# EAGLE design xcore_A (EAGLE 7.7.0)

## Sheet 1 of 2
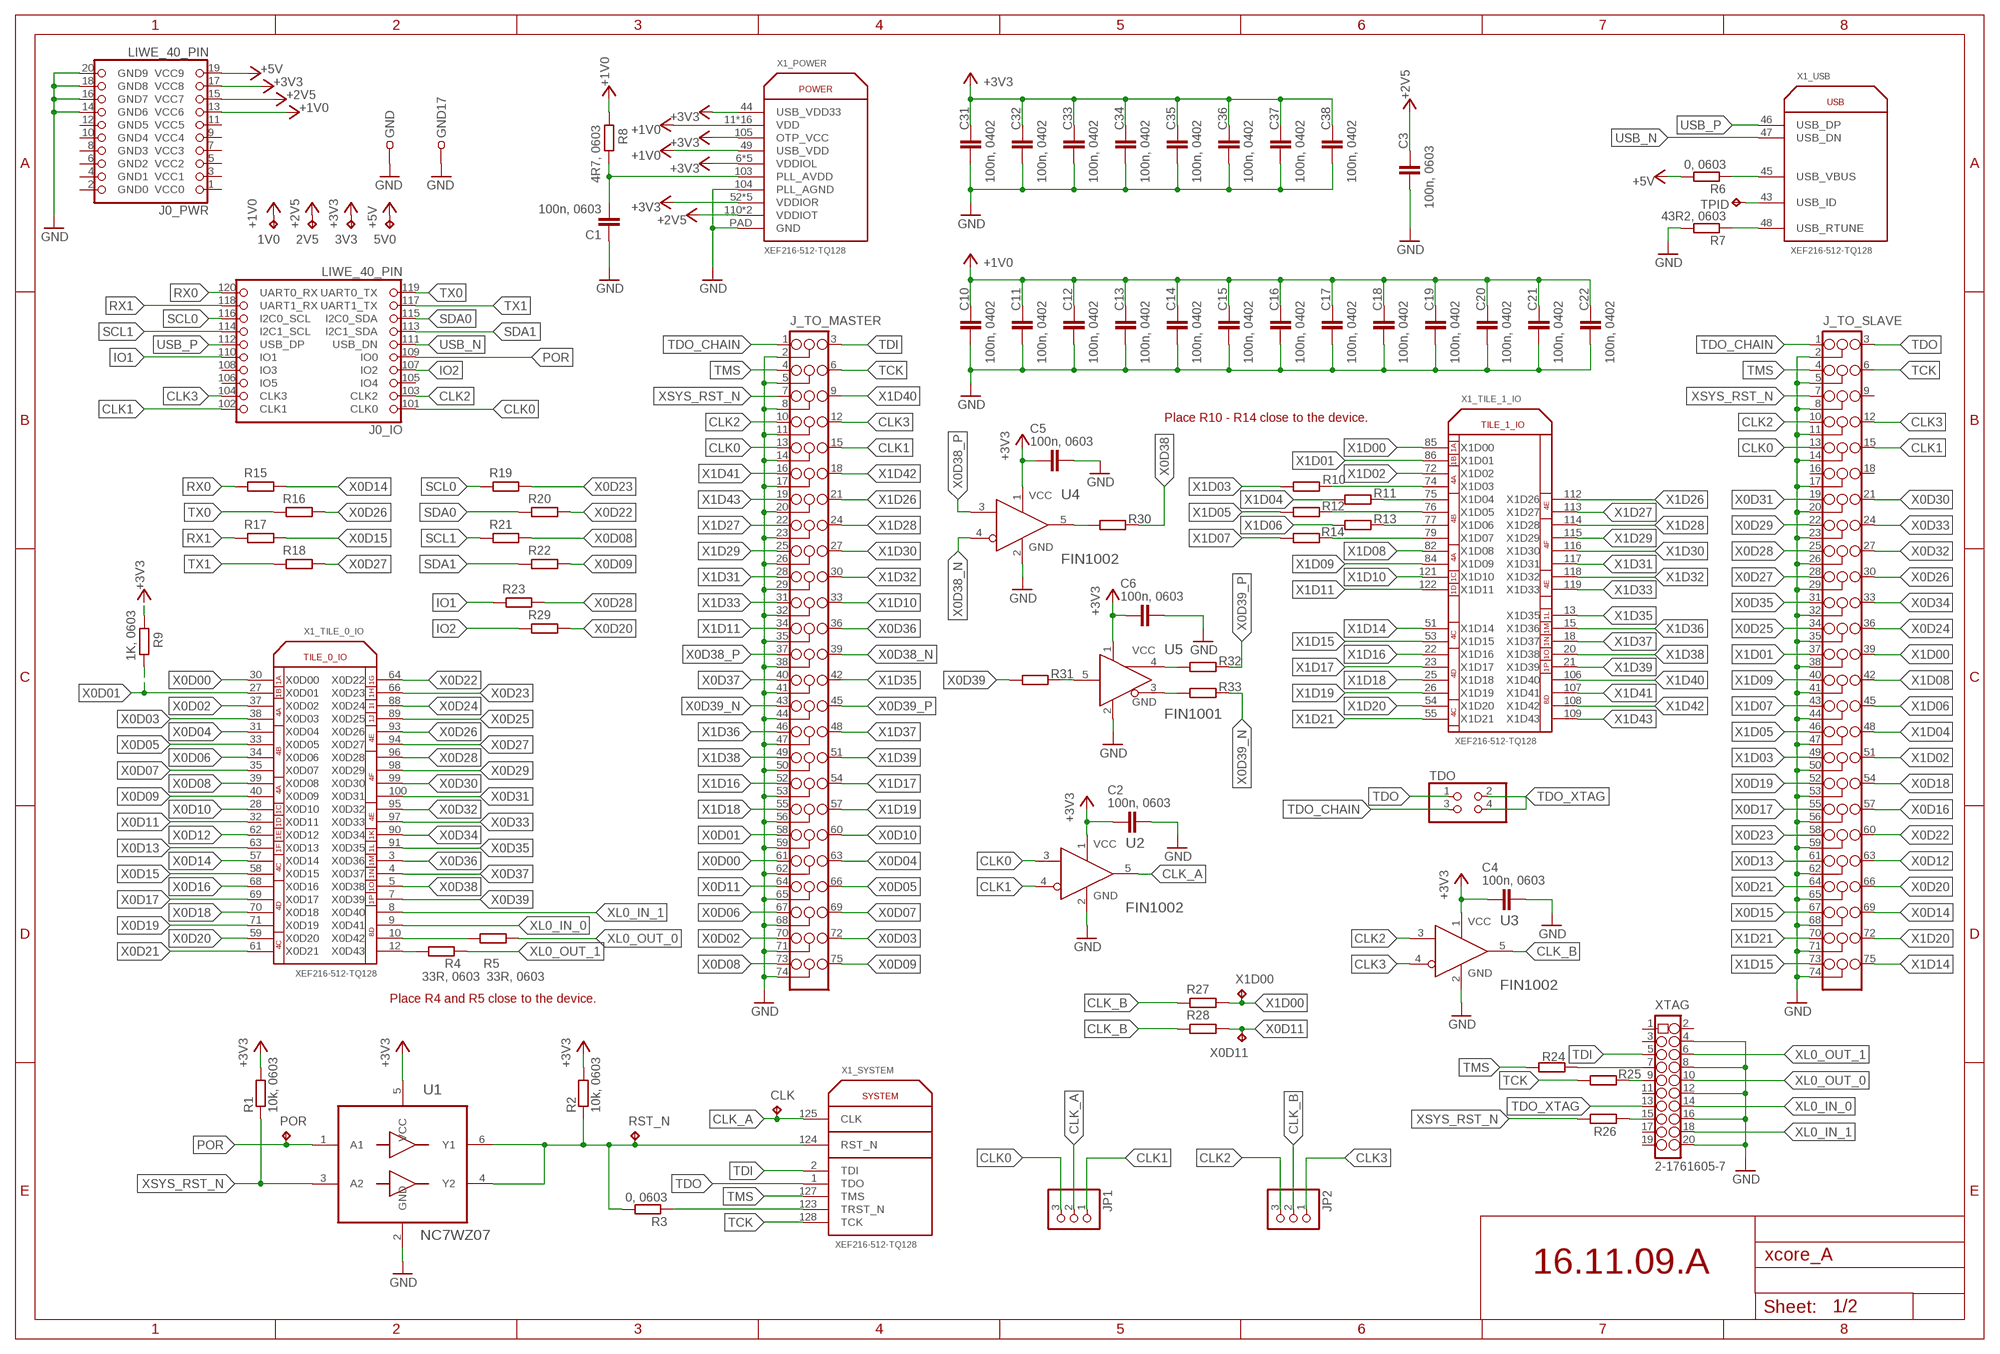
[diagram p0: schematic, sheet 1]

### Parts
1V0  TPTP14R  [TP14R]
2V5  TPTP14R  [TP14R]
3V3  TPTP14R  [TP14R]
5V0  TPTP14R  [TP14R]
C1  100n, 0603  C-EUC0603  [C0603]
C2  100n, 0603  C-EUC0603  [C0603]
C3  100n, 0603  C-EUC0402K  [C0402K]
C4  100n, 0603  C-EUC0603  [C0603]
C5  100n, 0603  C-EUC0603  [C0603]
C6  100n, 0603  C-EUC0603  [C0603]
C10  100n, 0402  C-EUC0402K  [C0402K]
C11  100n, 0402  C-EUC0402K  [C0402K]
C12  100n, 0402  C-EUC0402K  [C0402K]
C13  100n, 0402  C-EUC0402K  [C0402K]
C14  100n, 0402  C-EUC0402K  [C0402K]
C15  100n, 0402  C-EUC0402K  [C0402K]
C16  100n, 0402  C-EUC0402K  [C0402K]
C17  100n, 0402  C-EUC0402K  [C0402K]
C18  100n, 0402  C-EUC0402K  [C0402K]
C19  100n, 0402  C-EUC0402K  [C0402K]
C20  100n, 0402  C-EUC0402K  [C0402K]
C21  100n, 0402  C-EUC0402K  [C0402K]
C22  100n, 0402  C-EUC0402K  [C0402K]
C31  100n, 0402  C-EUC0402K  [C0402K]
C32  100n, 0402  C-EUC0402K  [C0402K]
C33  100n, 0402  C-EUC0402K  [C0402K]
C34  100n, 0402  C-EUC0402K  [C0402K]
C35  100n, 0402  C-EUC0402K  [C0402K]
C36  100n, 0402  C-EUC0402K  [C0402K]
C37  100n, 0402  C-EUC0402K  [C0402K]
C38  100n, 0402  C-EUC0402K  [C0402K]
CLK  TPTP14R  [TP14R]
GND  TEST-22-MULTICOMP  [TEST_1MM]
GND17  TEST-22-MULTICOMP  [TEST_1MM]
J0  LIWE_40_PIN  [LIWE_40_PIN_8X8]
J_TO_MASTER  TSW-125-08-G-T-RA  PINHD-3X25/90/M  [3X25/90/M]
J_TO_SLAVE  TSW-125-08-G-T-RA  PINHD-3X25/90  [3X25/90]
JP1  PINHD-1X3  [1X03]
JP2  PINHD-1X3  [1X03]
POR  TPTP14R  [TP14R]
R1  10k, 0603  R-EU_R0603  [R0603]
R2  10k, 0603  R-EU_R0603  [R0603]
R3  0, 0603  R-EU_R0603  [R0603]
R4  33R, 0603  R-EU_R0603  [R0603]
R5  33R, 0603  R-EU_R0603  [R0603]
R6  0, 0603  R-EU_R0603  [R0603]
R7  43R2, 0603  R-EU_R0603  [R0603]
R8  4R7, 0603  R-EU_R0603  [R0603]
R9  1K, 0603  R-EU_R0603  [R0603]
R10  R-EU_R0603  [R0603]
R11  R-EU_R0603  [R0603]
R12  R-EU_R0603  [R0603]
R13  R-EU_R0603  [R0603]
R14  R-EU_R0603  [R0603]
R15  R-EU_R0603  [R0603]
R16  R-EU_R0603  [R0603]
R17  R-EU_R0603  [R0603]
R18  R-EU_R0603  [R0603]
R19  R-EU_R0603  [R0603]
R20  R-EU_R0603  [R0603]
R21  R-EU_R0603  [R0603]
R22  R-EU_R0603  [R0603]
R23  R-EU_R0603  [R0603]
R24  R-EU_R0603  [R0603]
R25  R-EU_R0603  [R0603]
R26  R-EU_R0603  [R0603]
R27  R-EU_R0603  [R0603]
R28  R-EU_R0603  [R0603]
R29  R-EU_R0603  [R0603]
R30  R-EU_R0603  [R0603]
R31  R-EU_R0603  [R0603]
R32  R-EU_R0603  [R0603]
R33  R-EU_R0603  [R0603]
RST_N  TPTP14R  [TP14R]
TDO  PINHD-2X2  [2X02]
TPID  TPB1,27  [B1,27]
U1  NC7WZ07  [SOT65P210X110-6N]
U2  FIN1002  [SOT95P280X140-5N]
U3  FIN1002  [SOT95P280X140-5N]
U4  FIN1002  [SOT95P280X140-5N]
U5  FIN1001  [SOT95P280X140-5N]
X0D11  TPTP14R  [TP14R]
X1  XEF216-512-TQ128  [TQFP128]
X1D00  TPTP14R  [TP14R]
XTAG  2-1761605-7  PINHD-2X10  [2X10]

### Nets
+1V0: 1V0.TP C10.2 C11.2 C12.2 C13.2 C14.2 C15.2 C16.2 C17.2 C18.2 C19.2 C20.2 C21.2 C22.2 J0.13(_PWR:VCC6) R8.1 X1.11(_POWER:VDD) X1.16(_POWER:VDD) X1.17(_POWER:VDD) X1.24(_POWER:VDD) X1.36(_POWER:VDD) X1.41(_POWER:VDD) X1.49(_POWER:USB_VDD) X1.56(_POWER:VDD) X1.60(_POWER:VDD) X1.73(_POWER:VDD) X1.80(_POWER:VDD) X1.81(_POWER:VDD) X1.87(_POWER:VDD) X1.101(_POWER:VDD) X1.102(_POWER:VDD) X1.120(_POWER:VDD) X1.126(_POWER:VDD)
+2V5: 2V5.TP C3.2 J0.15(_PWR:VCC7) X1.110(_POWER:VDDIOT) X1.111(_POWER:VDDIOT)
+3V3: 3V3.TP C2.2 C4.2 C5.2 C6.2 C31.2 C32.2 C33.2 C34.2 C35.2 C36.2 C37.2 C38.2 J0.17(_PWR:VCC8) R1.2 R2.2 R9.1 U1.5(VCC) U2.1(VCC) U3.1(VCC) U4.1(VCC) U5.1(VCC) X1.6(_POWER:VDDIOL) X1.14(_POWER:VDDIOL) X1.19(_POWER:VDDIOL) X1.29(_POWER:VDDIOL) X1.42(_POWER:VDDIOL) X1.44(_POWER:USB_VDD33) X1.52(_POWER:VDDIOR) X1.67(_POWER:VDDIOR) X1.78(_POWER:VDDIOR) X1.83(_POWER:VDDIOR) X1.92(_POWER:VDDIOR) X1.105(_POWER:OTP_VCC)
+5V: 5V0.TP J0.19(_PWR:VCC9) R6.2
CLK0: J0.101(_IO:CLK0) J_TO_MASTER.13 J_TO_SLAVE.13 JP1.3 U2.3(RIN+)
CLK1: J0.102(_IO:CLK1) J_TO_MASTER.15 J_TO_SLAVE.15 JP1.1 U2.4(RIN-)
CLK2: J0.103(_IO:CLK2) J_TO_MASTER.10 J_TO_SLAVE.10 JP2.3 U3.3(RIN+)
CLK3: J0.104(_IO:CLK3) J_TO_MASTER.12 J_TO_SLAVE.12 JP2.1 U3.4(RIN-)
CLK_A: CLK.TP JP1.2 U2.5(ROUT) X1.125(_SYSTEM:CLK)
CLK_B: JP2.2 R27.1 R28.1 U3.5(ROUT)
GND: C1.1 C2.1 C3.1 C4.1 C5.1 C6.1 C10.1 C11.1 C12.1 C13.1 C14.1 C15.1 C16.1 C17.1 C18.1 C19.1 C20.1 C21.1 C22.1 C31.1 C32.1 C33.1 C34.1 C35.1 C36.1 C37.1 C38.1 GND17.1 GND.1 J0.14(_PWR:GND6) J0.16(_PWR:GND7) J0.18(_PWR:GND8) J0.20(_PWR:GND9) J_TO_MASTER.2 J_TO_MASTER.5 J_TO_MASTER.8 J_TO_MASTER.11 J_TO_MASTER.14 J_TO_MASTER.17 J_TO_MASTER.20 J_TO_MASTER.23 J_TO_MASTER.26 J_TO_MASTER.29 J_TO_MASTER.32 J_TO_MASTER.35 J_TO_MASTER.38 J_TO_MASTER.41 J_TO_MASTER.44 J_TO_MASTER.47 J_TO_MASTER.50 J_TO_MASTER.53 J_TO_MASTER.56 J_TO_MASTER.59 J_TO_MASTER.62 J_TO_MASTER.65 J_TO_MASTER.68 J_TO_MASTER.71 J_TO_MASTER.74 J_TO_SLAVE.2 J_TO_SLAVE.5 J_TO_SLAVE.8 J_TO_SLAVE.11 J_TO_SLAVE.14 J_TO_SLAVE.17 J_TO_SLAVE.20 J_TO_SLAVE.23 J_TO_SLAVE.26 J_TO_SLAVE.29 J_TO_SLAVE.32 J_TO_SLAVE.35 J_TO_SLAVE.38 J_TO_SLAVE.41 J_TO_SLAVE.44 J_TO_SLAVE.47 J_TO_SLAVE.50 J_TO_SLAVE.53 J_TO_SLAVE.56 J_TO_SLAVE.59 J_TO_SLAVE.62 J_TO_SLAVE.65 J_TO_SLAVE.68 J_TO_SLAVE.71 J_TO_SLAVE.74 R7.2 U1.2(GND) U2.2(GND) U3.2(GND) U4.2(GND) U5.2(GND) X1.104(_POWER:PLL_AGND) X1.PAD(_POWER:GND) XTAG.4 XTAG.8 XTAG.12 XTAG.16 XTAG.20
IO1: J0.110(_IO:IO1) R23.1
IO2: J0.107(_IO:IO2) R29.1
N$1: R10.2 X1.74(_TILE_1_IO:X1D03)
N$2: R11.2 X1.75(_TILE_1_IO:X1D04)
N$3: R12.2 X1.76(_TILE_1_IO:X1D05)
N$4: R13.2 X1.77(_TILE_1_IO:X1D06)
N$5: R14.2 X1.79(_TILE_1_IO:X1D07)
N$6: R30.1 U4.5(ROUT)
N$7: R31.2 U5.5(RIN)
N$10: R32.1 U5.4(ROUT+)
N$11: R33.1 U5.3(ROUT-)
PLL_AVDD: C1.2 R8.2 X1.103(_POWER:PLL_AVDD)
POR: J0.109(_IO:IO0) POR.TP U1.1(A1)
RST_N: R2.1 R3.2 RST_N.TP U1.4(Y2) U1.6(Y1) X1.124(_SYSTEM:RST_N)
RX0: J0.120(_IO:UART0_RX) R15.1
RX1: J0.118(_IO:UART1_RX) R17.1
SCL0: J0.116(_IO:I2C0_SCL) R19.1
SCL1: J0.114(_IO:I2C1_SCL) R21.1
SDA0: J0.115(_IO:I2C0_SDA) R20.1
SDA1: J0.113(_IO:I2C1_SDA) R22.1
TCK: J_TO_MASTER.6 J_TO_SLAVE.6 R25.1 X1.128(_SYSTEM:TCK)
TCK_: R25.2 XTAG.9
TDI: J_TO_MASTER.3 X1.2(_SYSTEM:TDI) XTAG.5
TDO: J_TO_SLAVE.3 TDO.1 X1.1(_SYSTEM:TDO)
TDO_CHAIN: J_TO_MASTER.1 J_TO_SLAVE.1 TDO.3
TDO_XTAG: TDO.2 TDO.4 XTAG.13
TMS: J_TO_MASTER.4 J_TO_SLAVE.4 R24.1 X1.127(_SYSTEM:TMS)
TMS_: R24.2 XTAG.7
TRST_N: R3.1 X1.123(_SYSTEM:TRST_N)
TX0: J0.119(_IO:UART0_TX) R16.1
TX1: J0.117(_IO:UART1_TX) R18.1
USB_ID: TPID.TP X1.43(_USB:USB_ID)
USB_N: J0.111(_IO:USB_DN) X1.47(_USB:USB_DN)
USB_P: J0.112(_IO:USB_DP) X1.46(_USB:USB_DP)
USB_RTUNE: R7.1 X1.48(_USB:USB_RTUNE)
USB_VBUS: R6.1 X1.45(_USB:USB_VBUS)
X0D00: J_TO_MASTER.61 X1.30(_TILE_0_IO:X0D00)
X0D01: J_TO_MASTER.58 R9.2 X1.27(_TILE_0_IO:X0D01)
X0D02: J_TO_MASTER.70 X1.37(_TILE_0_IO:X0D02)
X0D03: J_TO_MASTER.72 X1.38(_TILE_0_IO:X0D03)
X0D04: J_TO_MASTER.63 X1.31(_TILE_0_IO:X0D04)
X0D05: J_TO_MASTER.66 X1.33(_TILE_0_IO:X0D05)
X0D06: J_TO_MASTER.67 X1.34(_TILE_0_IO:X0D06)
X0D07: J_TO_MASTER.69 X1.35(_TILE_0_IO:X0D07)
X0D08: J_TO_MASTER.73 R21.2 X1.39(_TILE_0_IO:X0D08)
X0D09: J_TO_MASTER.75 R22.2 X1.40(_TILE_0_IO:X0D09)
X0D10: J_TO_MASTER.60 X1.28(_TILE_0_IO:X0D10)
X0D11: J_TO_MASTER.64 R28.2 X0D11.TP X1.32(_TILE_0_IO:X0D11)
X0D12: J_TO_SLAVE.63 X1.62(_TILE_0_IO:X0D12)
X0D13: J_TO_SLAVE.61 X1.63(_TILE_0_IO:X0D13)
X0D14: J_TO_SLAVE.69 R15.2 X1.57(_TILE_0_IO:X0D14)
X0D15: J_TO_SLAVE.67 R17.2 X1.58(_TILE_0_IO:X0D15)
X0D16: J_TO_SLAVE.57 X1.68(_TILE_0_IO:X0D16)
X0D17: J_TO_SLAVE.55 X1.69(_TILE_0_IO:X0D17)
X0D18: J_TO_SLAVE.54 X1.70(_TILE_0_IO:X0D18)
X0D19: J_TO_SLAVE.52 X1.71(_TILE_0_IO:X0D19)
X0D20: J_TO_SLAVE.66 R29.2 X1.59(_TILE_0_IO:X0D20)
X0D21: J_TO_SLAVE.64 X1.61(_TILE_0_IO:X0D21)
X0D22: J_TO_SLAVE.60 R20.2 X1.64(_TILE_0_IO:X0D22)
X0D23: J_TO_SLAVE.58 R19.2 X1.66(_TILE_0_IO:X0D23)
X0D24: J_TO_SLAVE.36 X1.88(_TILE_0_IO:X0D24)
X0D25: J_TO_SLAVE.34 X1.89(_TILE_0_IO:X0D25)
X0D26: J_TO_SLAVE.30 R16.2 X1.93(_TILE_0_IO:X0D26)
X0D27: J_TO_SLAVE.28 R18.2 X1.94(_TILE_0_IO:X0D27)
X0D28: J_TO_SLAVE.25 R23.2 X1.96(_TILE_0_IO:X0D28)
X0D29: J_TO_SLAVE.22 X1.98(_TILE_0_IO:X0D29)
X0D30: J_TO_SLAVE.21 X1.99(_TILE_0_IO:X0D30)
X0D31: J_TO_SLAVE.19 X1.100(_TILE_0_IO:X0D31)
X0D32: J_TO_SLAVE.27 X1.95(_TILE_0_IO:X0D32)
X0D33: J_TO_SLAVE.24 X1.97(_TILE_0_IO:X0D33)
X0D34: J_TO_SLAVE.33 X1.90(_TILE_0_IO:X0D34)
X0D35: J_TO_SLAVE.31 X1.91(_TILE_0_IO:X0D35)
X0D36: J_TO_MASTER.36 X1.3(_TILE_0_IO:X0D36)
X0D37: J_TO_MASTER.40 X1.4(_TILE_0_IO:X0D37)
X0D38: R30.2 X1.5(_TILE_0_IO:X0D38)
X0D38_N: J_TO_MASTER.39 U4.4(RIN-)
X0D38_P: J_TO_MASTER.37 U4.3(RIN+)
X0D39: R31.1 X1.7(_TILE_0_IO:X0D39)
X0D39_N: J_TO_MASTER.43 R33.2
X0D39_P: J_TO_MASTER.45 R32.2
X0D42: R5.2 X1.10(_TILE_0_IO:X0D42)
X0D43: R4.2 X1.12(_TILE_0_IO:X0D43)
X1D00: J_TO_SLAVE.39 R27.2 X1.85(_TILE_1_IO:X1D00) X1D00.TP
X1D01: J_TO_SLAVE.37 X1.86(_TILE_1_IO:X1D01)
X1D02: J_TO_SLAVE.51 X1.72(_TILE_1_IO:X1D02)
X1D03: J_TO_SLAVE.49 R10.1
X1D04: J_TO_SLAVE.48 R11.1
X1D05: J_TO_SLAVE.46 R12.1
X1D06: J_TO_SLAVE.45 R13.1
X1D07: J_TO_SLAVE.43 R14.1
X1D08: J_TO_SLAVE.42 X1.82(_TILE_1_IO:X1D08)
X1D09: J_TO_SLAVE.40 X1.84(_TILE_1_IO:X1D09)
X1D10: J_TO_MASTER.33 X1.121(_TILE_1_IO:X1D10)
X1D11: J_TO_MASTER.34 X1.122(_TILE_1_IO:X1D11)
X1D14: J_TO_SLAVE.75 X1.51(_TILE_1_IO:X1D14)
X1D15: J_TO_SLAVE.73 X1.53(_TILE_1_IO:X1D15)
X1D16: J_TO_MASTER.52 X1.22(_TILE_1_IO:X1D16)
X1D17: J_TO_MASTER.54 X1.23(_TILE_1_IO:X1D17)
X1D18: J_TO_MASTER.55 X1.25(_TILE_1_IO:X1D18)
X1D19: J_TO_MASTER.57 X1.26(_TILE_1_IO:X1D19)
X1D20: J_TO_SLAVE.72 X1.54(_TILE_1_IO:X1D20)
X1D21: J_TO_SLAVE.70 X1.55(_TILE_1_IO:X1D21)
X1D26: J_TO_MASTER.21 X1.112(_TILE_1_IO:X1D26)
X1D27: J_TO_MASTER.22 X1.113(_TILE_1_IO:X1D27)
X1D28: J_TO_MASTER.24 X1.114(_TILE_1_IO:X1D28)
X1D29: J_TO_MASTER.25 X1.115(_TILE_1_IO:X1D29)
X1D30: J_TO_MASTER.27 X1.116(_TILE_1_IO:X1D30)
X1D31: J_TO_MASTER.28 X1.117(_TILE_1_IO:X1D31)
X1D32: J_TO_MASTER.30 X1.118(_TILE_1_IO:X1D32)
X1D33: J_TO_MASTER.31 X1.119(_TILE_1_IO:X1D33)
X1D35: J_TO_MASTER.42 X1.13(_TILE_1_IO:X1D35)
X1D36: J_TO_MASTER.46 X1.15(_TILE_1_IO:X1D36)
X1D37: J_TO_MASTER.48 X1.18(_TILE_1_IO:X1D37)
X1D38: J_TO_MASTER.49 X1.20(_TILE_1_IO:X1D38)
X1D39: J_TO_MASTER.51 X1.21(_TILE_1_IO:X1D39)
X1D40: J_TO_MASTER.9 X1.106(_TILE_1_IO:X1D40)
X1D41: J_TO_MASTER.16 X1.107(_TILE_1_IO:X1D41)
X1D42: J_TO_MASTER.18 X1.108(_TILE_1_IO:X1D42)
X1D43: J_TO_MASTER.19 X1.109(_TILE_1_IO:X1D43)
XL0_IN_0: X1.9(_TILE_0_IO:X0D41) XTAG.14
XL0_IN_1: X1.8(_TILE_0_IO:X0D40) XTAG.18
XL0_OUT_0: R5.1 XTAG.10
XL0_OUT_1: R4.1 XTAG.6
XSYS_RST_N: J_TO_MASTER.7 J_TO_SLAVE.7 R1.1 R26.1 U1.3(A2)
XSYS_RST_N_: R26.2 XTAG.15
Unconnected: J0.1(_PWR:VCC0) J0.2(_PWR:GND0) J0.3(_PWR:VCC1) J0.4(_PWR:GND1) J0.5(_PWR:VCC2) J0.6(_PWR:GND2) J0.7(_PWR:VCC3) J0.8(_PWR:GND3) J0.9(_PWR:VCC4) J0.10(_PWR:GND4) J0.11(_PWR:VCC5) J0.12(_PWR:GND5) J0.105(_IO:IO4) J0.106(_IO:IO5) J0.108(_IO:IO3) J_TO_SLAVE.9 J_TO_SLAVE.16 J_TO_SLAVE.18 XTAG.1 XTAG.2 XTAG.3 XTAG.11 XTAG.17 XTAG.19

### Notes on the sheet
- Place R10 - R14 close to the device.
- Place R4 and R5 close to the device.
- 16.11.09.A

## Sheet 2 of 2
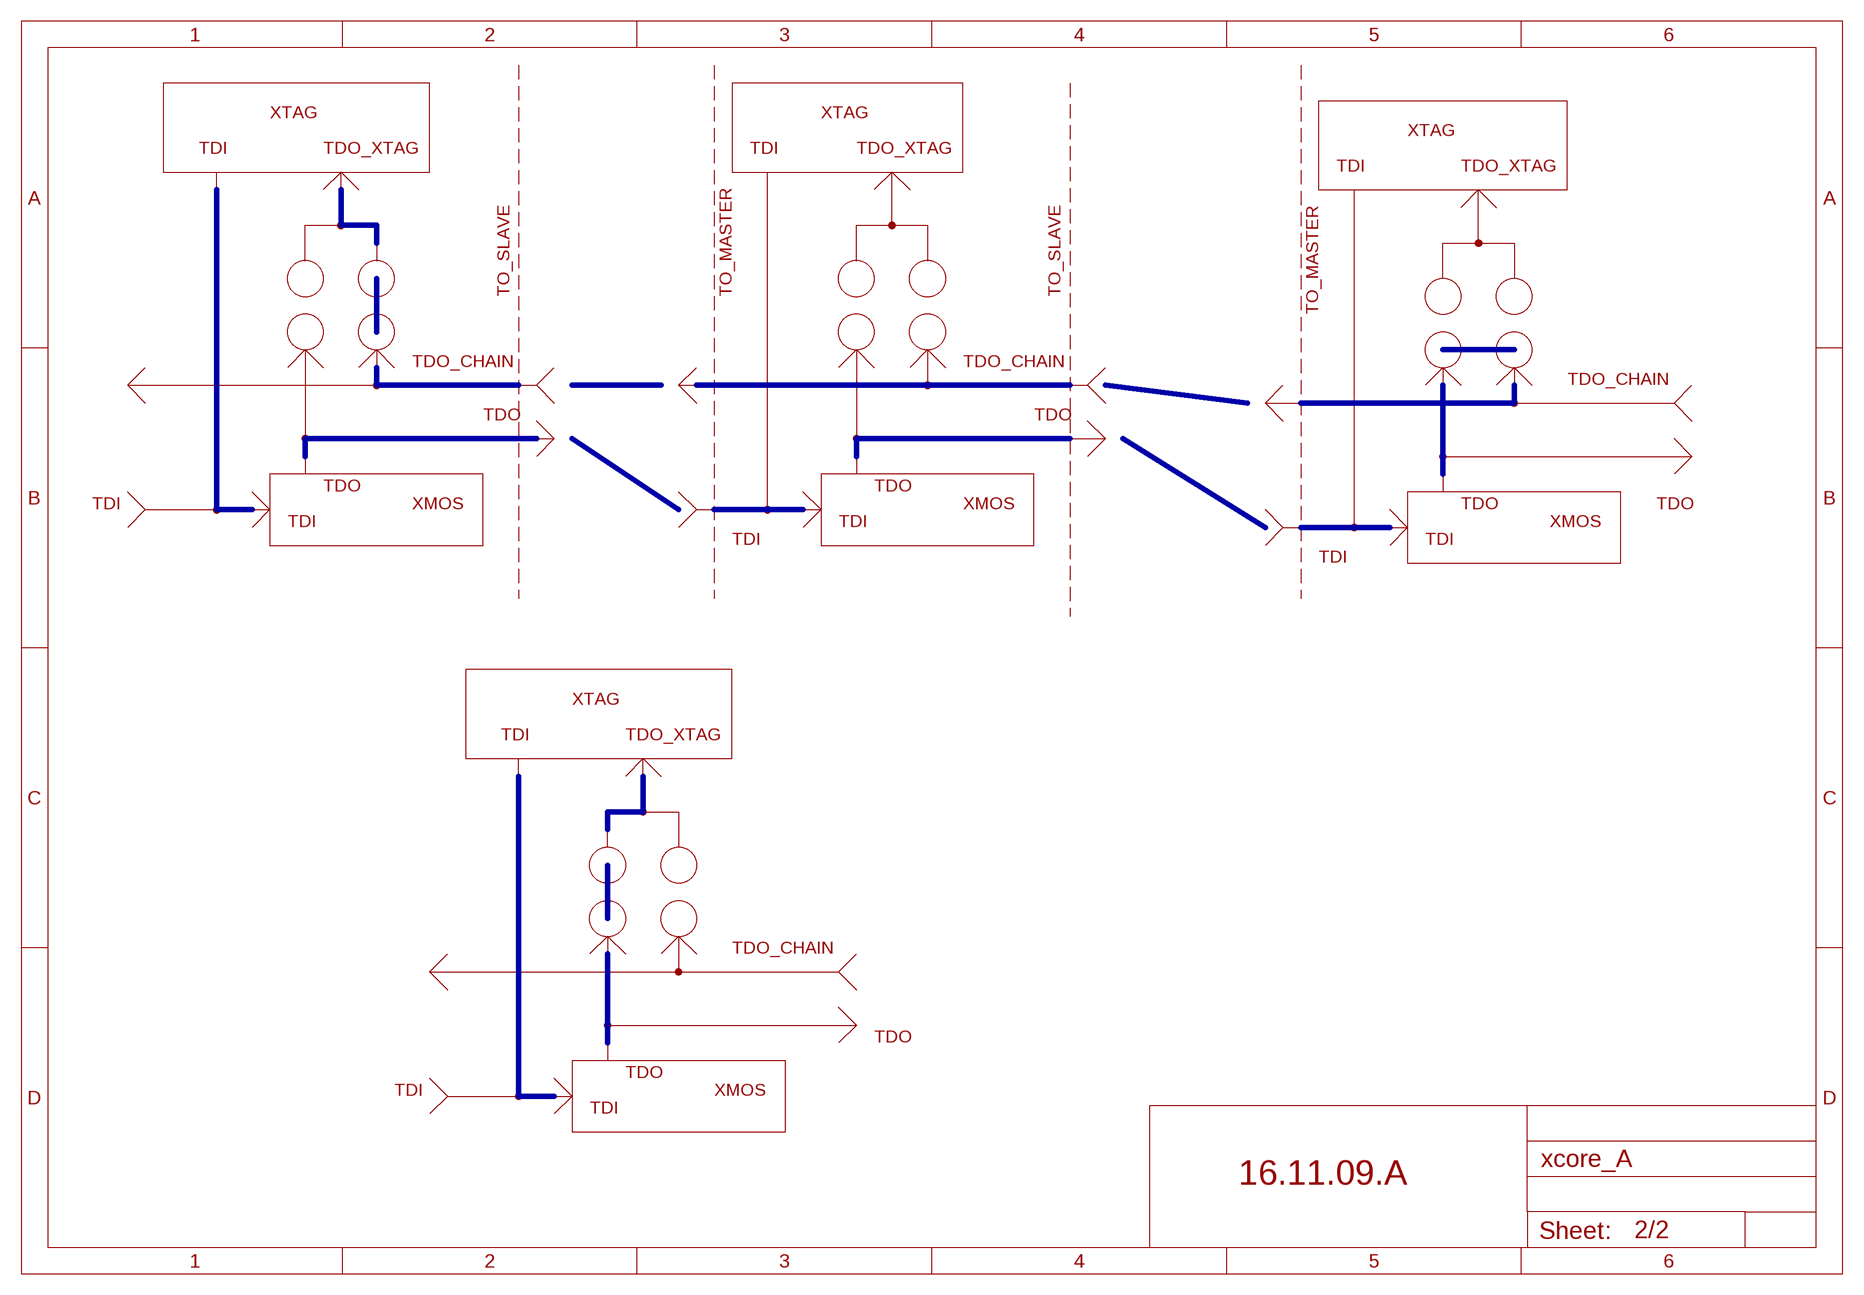
[diagram p1: schematic, sheet 2]

### Buses
B$1
B$2
B$3
B$4
B$5
B$6
B$7
B$8
B$9
B$10
B$11
B$12
B$13
B$14
B$15
B$16
B$17
B$18
B$19
B$20

### Notes on the sheet
- XTAG | XTAG
- XTAG
- TDI | TDO_XTAG | TDI | TDO_XTAG
- TDI | TDO_XTAG
- TO_SLAVE | TO_MASTER | TO_SLAVE
- TO_MASTER
- TDO_CHAIN | TDO_CHAIN
- TDO_CHAIN
- TDO | TDO
- TDO | TDO
- TDI | XMOS | XMOS | TDO | TDO
- TDI | TDI | XMOS
- TDI | TDI
- TDI
- XTAG
- TDI | TDO_XTAG
- TDO_CHAIN
- TDO
- TDO
- TDI | XMOS
- TDI
- 16.11.09.A

## Library data of the parts
1V0 2V5 3V3 5V0 CLK POR RST_N TPID X0D11 X1D00 = testpad:TP: Test pad
C1-C6 C10-C22 C31-C38 = rcl:C-EU: CAPACITOR, European symbol
GND GND17 = 25cmsquare:TEST-22-MULTICOMP: MULTICOMP TEST-22 TEST PIN, PCB, 1.0MM FARNELL: 1702010
J0 = 25cmsquare:LIWE_40_PIN
J_TO_MASTER J_TO_SLAVE = 25pinhead:PINHD-3X25
JP1 JP2 = 25pinhead:PINHD-1X3: PIN HEADER
R1-R33 = rcl:R-EU_: RESISTOR, European symbol
TDO = 25pinhead:PINHD-2X2: PIN HEADER
U1 = 25cmsquare:NC7WZ07
U2-U4 = 25cmsquare:FIN1002
U5 = 25cmsquare:FIN1001
X1 = 25cmsquare:XEF216-512-TQ128
XTAG = 25pinhead:PINHD-2X10: PIN HEADER

## Board
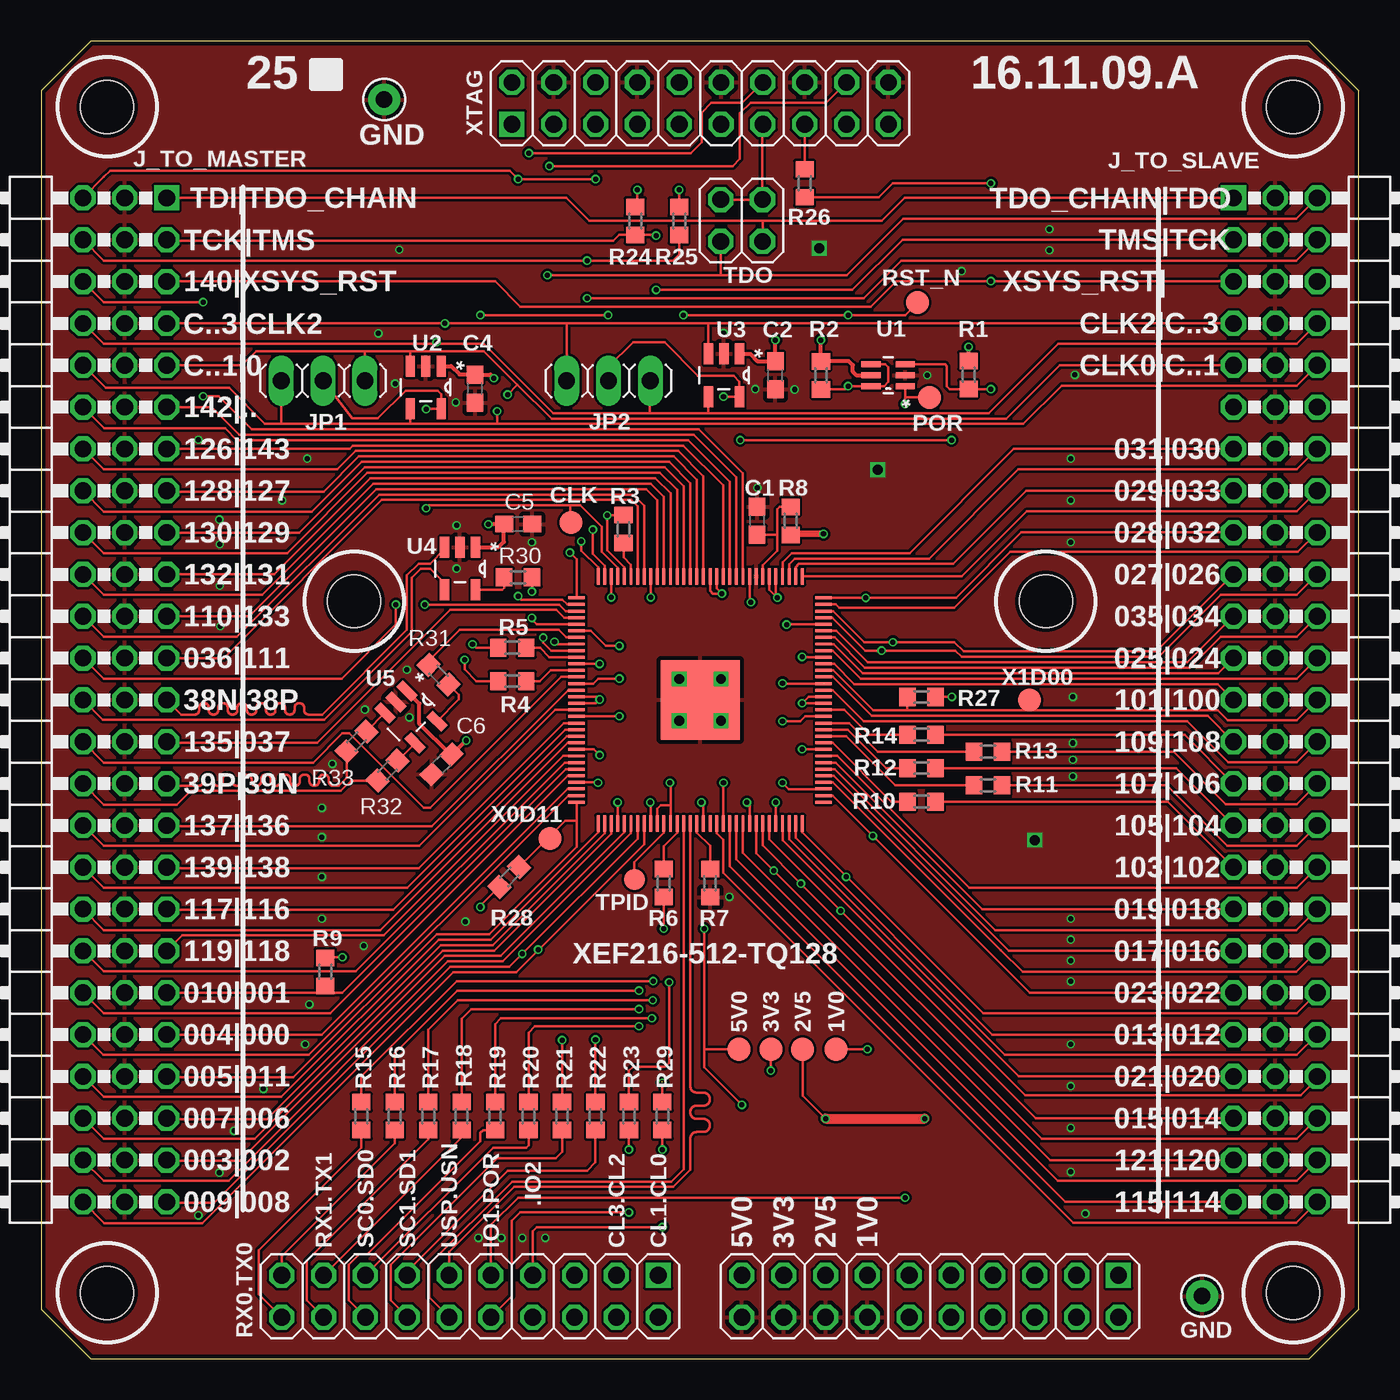
[diagram p2: board, top side]
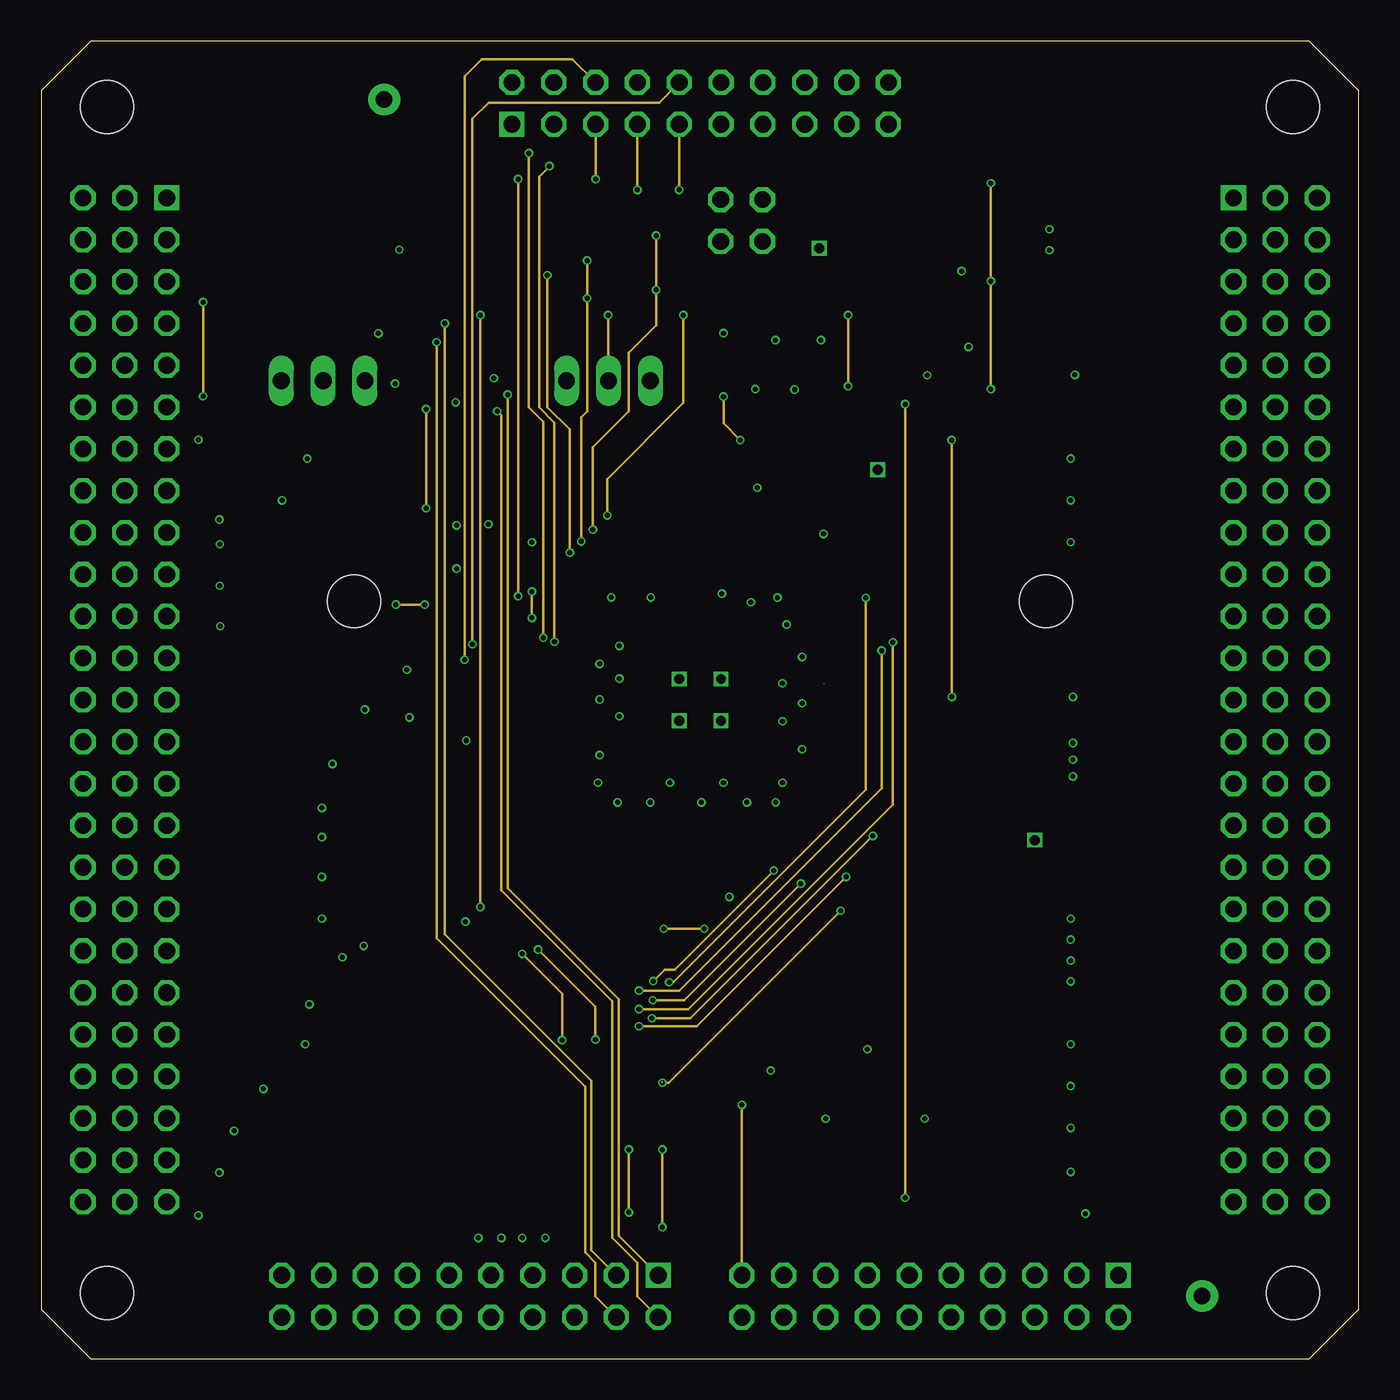
[diagram p3: board, inner layer Route2]
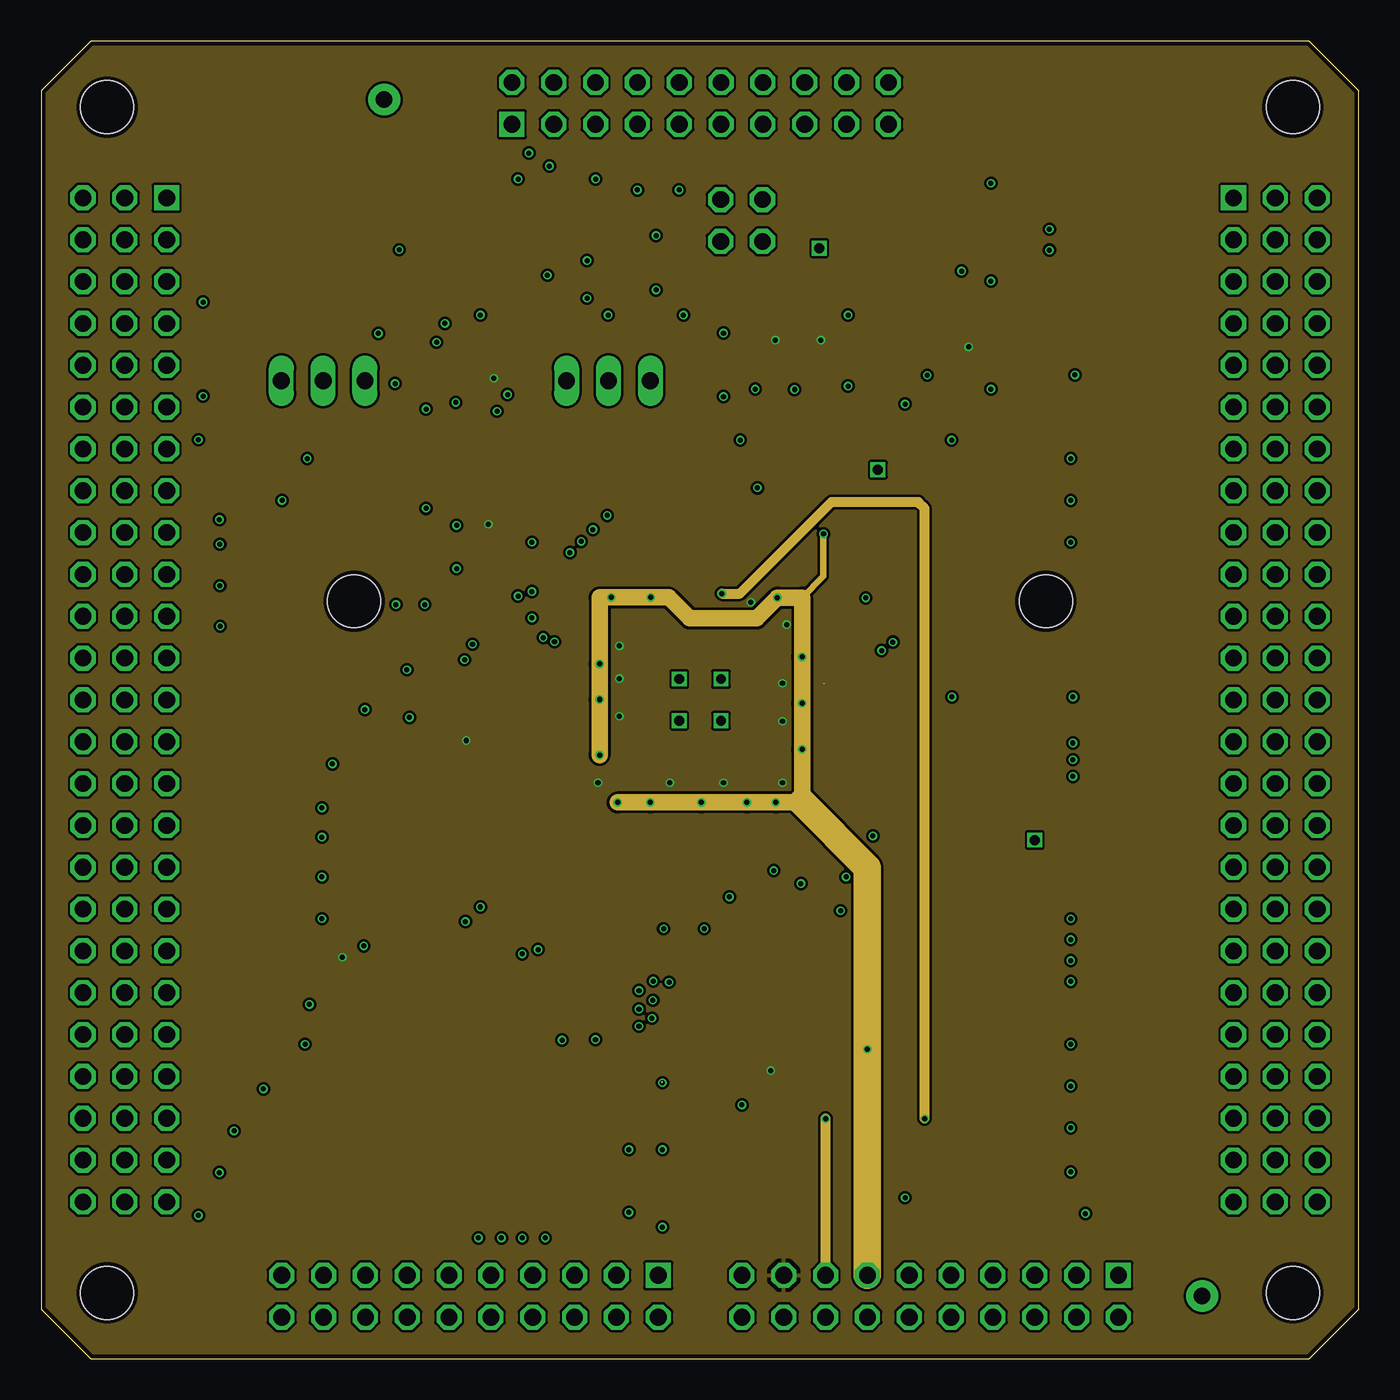
[diagram p4: board, inner layer Route15]
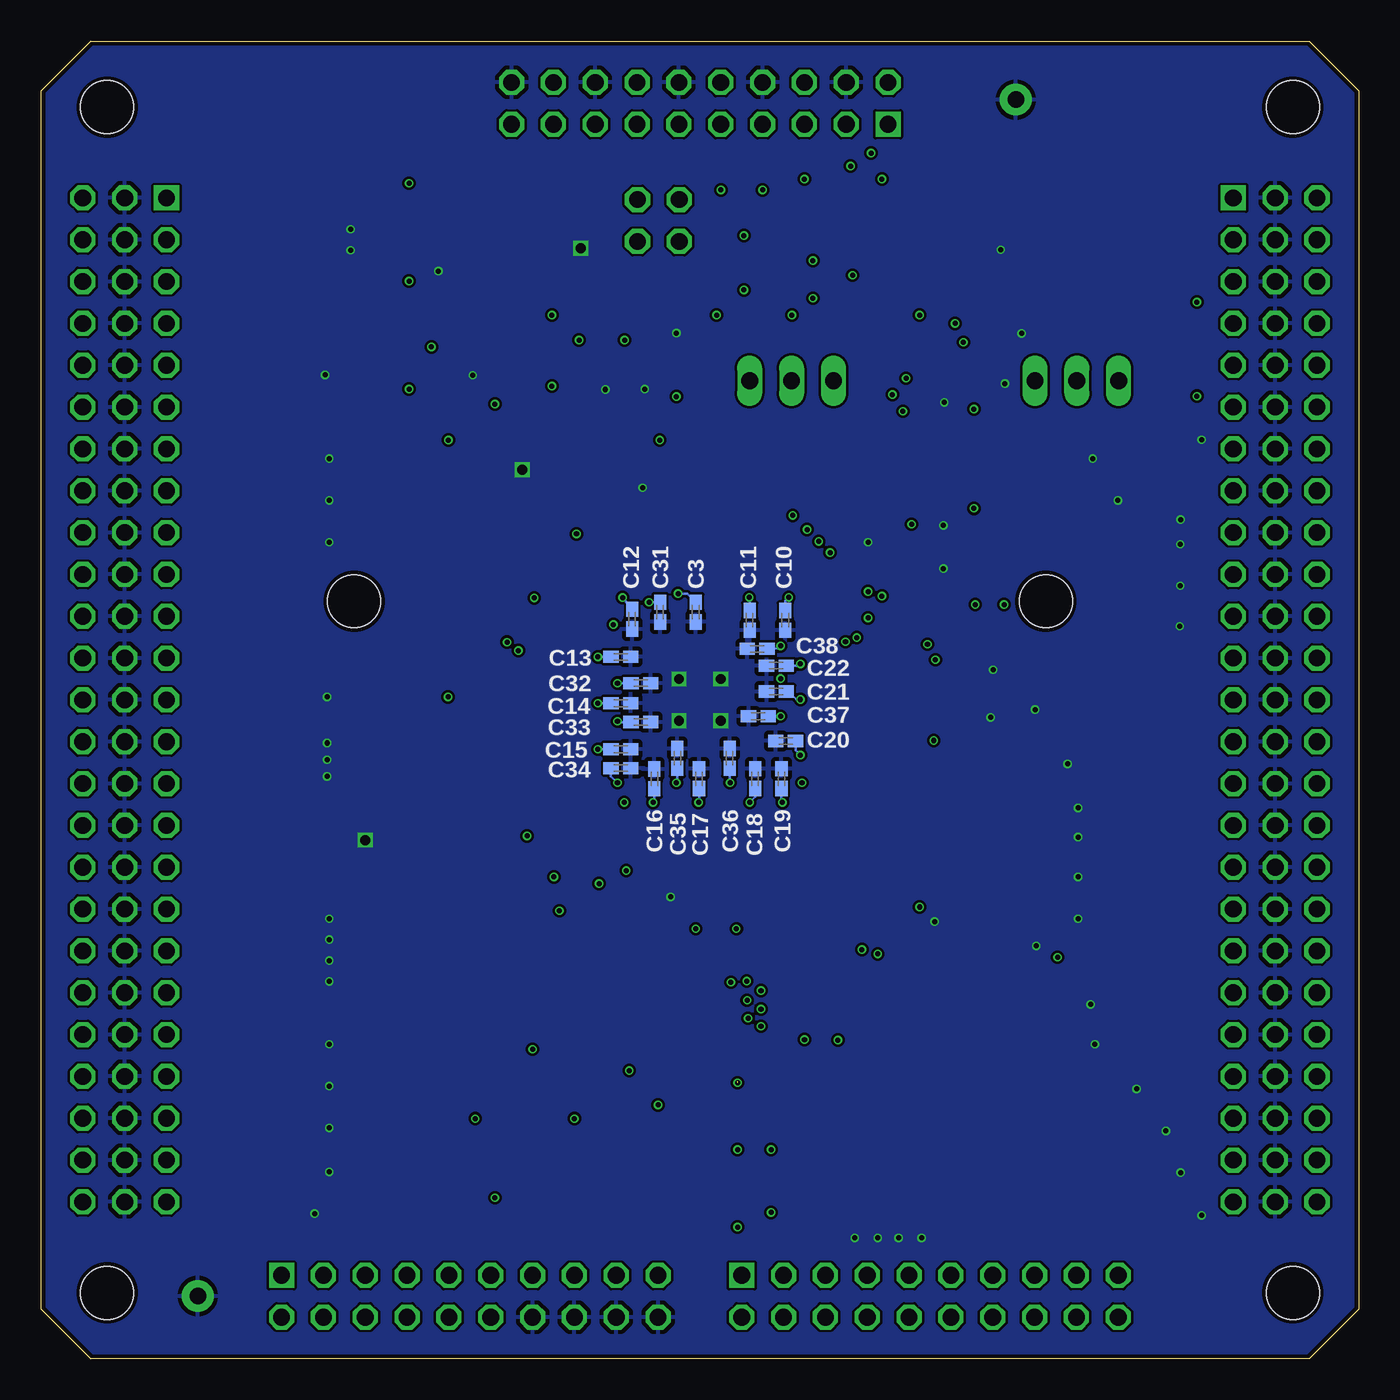
[diagram p5: board, bottom side, seen from below]

Size 80 x 80 mm. Coordinates in mm from the lower left corner, seen from the top.
Copper layers (1*2*15*16): Top 0.035mm / dielectric 0.2mm / Route2 0.0175mm / dielectric 0.3mm / Route15 0.0175mm / dielectric 0.2mm / Bottom 0.035mm
Design rules "SeeedStudio_4layer_DRU_no_angle_20140221 *": minimum track width 6mil, minimum drill 12mil, track to track 6mil, track to pad 6mil, pad to pad 6mil, via to via 6mil, smd to smd 0mil, copper to edge 10mil, drill to drill 8mil, minimum pad ring 6mil, minimum via ring 4mil, stop-mask expansion 4mil, vias tented up to drill 25mil, thermal gap 10mil

### Footprints (pad centres in the part's own frame; a part is rotated, then mirrored left to right if it is on the bottom)
TP14R = smd 1.4 x 1.4: TP 0,0
C0603 = smd 1.1 x 1: 1 -0.85,0; 2 0.85,0
C0402K = smd 0.925 x 0.74: 1 -0.6,0; 2 0.6,0
TEST_1MM = drill 1 pad 1.93: 1 0,0
LIWE_40_PIN_8X8 = drill 1.016 square: 1 74.93,65.405; 101 74.93,37.465 | drill 1.016 octagon: 2 77.47,65.405; 3 74.93,62.865; 4 77.47,62.865; 5 74.93,60.325; 6 77.47,60.325; 7 74.93,57.785; 8 77.47,57.785; 9 74.93,55.245; 10 77.47,55.245; 11 74.93,52.705; 12 77.47,52.705; 13 74.93,50.165; 14 77.47,50.165; 15 74.93,47.625; 16 77.47,47.625; 17 74.93,45.085; 18 77.47,45.085; 19 74.93,42.545; 20 77.47,42.545; 102 77.47,37.465; 103 74.93,34.925; 104 77.47,34.925; 105 74.93,32.385; 106 77.47,32.385; 107 74.93,29.845; 108 77.47,29.845; 109 74.93,27.305; 110 77.47,27.305; 111 74.93,24.765; 112 77.47,24.765; 113 74.93,22.225; 114 77.47,22.225; 115 74.93,19.685; 116 77.47,19.685; 117 74.93,17.145; 118 77.47,17.145; 119 74.93,14.605; 120 77.47,14.605 | hole 3.2: 34,19; 34,61; 4,76; 4,4; 76,4; 76,76
3X25/90/M = drill 1.016 square: 1 0,0 | drill 1.016 octagon: 2 0,2.54; 3 0,5.08; 4 -2.54,0; 5 -2.54,2.54; 6 -2.54,5.08; 7 -5.08,0; 8 -5.08,2.54; 9 -5.08,5.08; 10 -7.62,0; 11 -7.62,2.54; 12 -7.62,5.08; 13 -10.16,0; 14 -10.16,2.54; 15 -10.16,5.08; 16 -12.7,0; 17 -12.7,2.54; 18 -12.7,5.08; 19 -15.24,0; 20 -15.24,2.54; 21 -15.24,5.08; 22 -17.78,0; 23 -17.78,2.54; 24 -17.78,5.08; 25 -20.32,0; 26 -20.32,2.54; 27 -20.32,5.08; 28 -22.86,0; 29 -22.86,2.54; 30 -22.86,5.08; 31 -25.4,0; 32 -25.4,2.54; 33 -25.4,5.08; 34 -27.94,0; 35 -27.94,2.54; 36 -27.94,5.08; 37 -30.48,0; 38 -30.48,2.54; 39 -30.48,5.08; 40 -33.02,0; 41 -33.02,2.54; 42 -33.02,5.08; 43 -35.56,0; 44 -35.56,2.54; 45 -35.56,5.08; 46 -38.1,0; 47 -38.1,2.54; 48 -38.1,5.08; 49 -40.64,0; 50 -40.64,2.54; 51 -40.64,5.08; 52 -43.18,0; 53 -43.18,2.54; 54 -43.18,5.08; 55 -45.72,0; 56 -45.72,2.54; 57 -45.72,5.08; 58 -48.26,0; 59 -48.26,2.54; 60 -48.26,5.08; 61 -50.8,0; 62 -50.8,2.54; 63 -50.8,5.08; 64 -53.34,0; 65 -53.34,2.54; 66 -53.34,5.08; 67 -55.88,0; 68 -55.88,2.54; 69 -55.88,5.08; 70 -58.42,0; 71 -58.42,2.54; 72 -58.42,5.08; 73 -60.96,0; 74 -60.96,2.54; 75 -60.96,5.08
3X25/90 = drill 1.016 square: 1 0,0 | drill 1.016 octagon: 2 0,2.54; 3 0,5.08; 4 2.54,0; 5 2.54,2.54; 6 2.54,5.08; 7 5.08,0; 8 5.08,2.54; 9 5.08,5.08; 10 7.62,0; 11 7.62,2.54; 12 7.62,5.08; 13 10.16,0; 14 10.16,2.54; 15 10.16,5.08; 16 12.7,0; 17 12.7,2.54; 18 12.7,5.08; 19 15.24,0; 20 15.24,2.54; 21 15.24,5.08; 22 17.78,0; 23 17.78,2.54; 24 17.78,5.08; 25 20.32,0; 26 20.32,2.54; 27 20.32,5.08; 28 22.86,0; 29 22.86,2.54; 30 22.86,5.08; 31 25.4,0; 32 25.4,2.54; 33 25.4,5.08; 34 27.94,0; 35 27.94,2.54; 36 27.94,5.08; 37 30.48,0; 38 30.48,2.54; 39 30.48,5.08; 40 33.02,0; 41 33.02,2.54; 42 33.02,5.08; 43 35.56,0; 44 35.56,2.54; 45 35.56,5.08; 46 38.1,0; 47 38.1,2.54; 48 38.1,5.08; 49 40.64,0; 50 40.64,2.54; 51 40.64,5.08; 52 43.18,0; 53 43.18,2.54; 54 43.18,5.08; 55 45.72,0; 56 45.72,2.54; 57 45.72,5.08; 58 48.26,0; 59 48.26,2.54; 60 48.26,5.08; 61 50.8,0; 62 50.8,2.54; 63 50.8,5.08; 64 53.34,0; 65 53.34,2.54; 66 53.34,5.08; 67 55.88,0; 68 55.88,2.54; 69 55.88,5.08; 70 58.42,0; 71 58.42,2.54; 72 58.42,5.08; 73 60.96,0; 74 60.96,2.54; 75 60.96,5.08
1X03 = drill 1.016 long: 1 -2.54,0; 2 0,0; 3 2.54,0
R0603 = smd 1 x 1.1: 1 -0.85,0; 2 0.85,0
2X02 = drill 1.016 octagon: 1 -1.27,-1.27; 2 -1.27,1.27; 3 1.27,-1.27; 4 1.27,1.27
B1,27 = smd 1.27 x 1.27: TP 0,0
SOT65P210X110-6N = smd 1.168 x 0.356: 1 -1.041,0.66; 2 -1.041,0; 3 -1.041,-0.66; 4 1.041,-0.66; 5 1.041,0; 6 1.041,0.66
SOT95P280X140-5N = smd 1.27 x 0.559: 1 -1.295,0.94; 2 -1.295,0; 3 -1.295,-0.94; 4 1.295,-0.94; 5 1.295,0.94
TQFP128 = smd 1 x 0.18: 1 -7.5,6.2; 2 -7.5,5.8; 3 -7.5,5.4; 4 -7.5,5; 5 -7.5,4.6; 6 -7.5,4.2; 7 -7.5,3.8; 8 -7.5,3.4; 9 -7.5,3; 10 -7.5,2.6; 11 -7.5,2.2; 12 -7.5,1.8; 13 -7.5,1.4; 14 -7.5,1; 15 -7.5,0.6; 16 -7.5,0.2; 17 -7.5,-0.2; 18 -7.5,-0.6; 19 -7.5,-1; 20 -7.5,-1.4; 21 -7.5,-1.8; 22 -7.5,-2.2; 23 -7.5,-2.6; 24 -7.5,-3; 25 -7.5,-3.4; 26 -7.5,-3.8; 27 -7.5,-4.2; 28 -7.5,-4.6; 29 -7.5,-5; 30 -7.5,-5.4; 31 -7.5,-5.8; 32 -7.5,-6.2; 65 7.5,-6.2; 66 7.5,-5.8; 67 7.5,-5.4; 68 7.5,-5; 69 7.5,-4.6; 70 7.5,-4.2; 71 7.5,-3.8; 72 7.5,-3.4; 73 7.5,-3; 74 7.5,-2.6; 75 7.5,-2.2; 76 7.5,-1.8; 77 7.5,-1.4; 78 7.5,-1; 79 7.5,-0.6; 80 7.5,-0.2; 81 7.5,0.2; 82 7.5,0.6; 83 7.5,1; 84 7.5,1.4; 85 7.5,1.8; 86 7.5,2.2; 87 7.5,2.6; 88 7.5,3; 89 7.5,3.4; 90 7.5,3.8; 91 7.5,4.2; 92 7.5,4.6; 93 7.5,5; 94 7.5,5.4; 95 7.5,5.8; 96 7.5,6.2 | smd 0.18 x 1: 33 -6.2,-7.5; 34 -5.8,-7.5; 35 -5.4,-7.5; 36 -5,-7.5; 37 -4.6,-7.5; 38 -4.2,-7.5; 39 -3.8,-7.5; 40 -3.4,-7.5; 41 -3,-7.5; 42 -2.6,-7.5; 43 -2.2,-7.5; 44 -1.8,-7.5; 45 -1.4,-7.5; 46 -1,-7.5; 47 -0.6,-7.5; 48 -0.2,-7.5; 49 0.2,-7.5; 50 0.6,-7.5; 51 1,-7.5; 52 1.4,-7.5; 53 1.8,-7.5; 54 2.2,-7.5; 55 2.6,-7.5; 56 3,-7.5; 57 3.4,-7.5; 58 3.8,-7.5; 59 4.2,-7.5; 60 4.6,-7.5; 61 5,-7.5; 62 5.4,-7.5; 63 5.8,-7.5; 64 6.2,-7.5; 97 6.2,7.5; 98 5.8,7.5; 99 5.4,7.5; 100 5,7.5; 101 4.6,7.5; 102 4.2,7.5; 103 3.8,7.5; 104 3.4,7.5; 105 3,7.5; 106 2.6,7.5; 107 2.2,7.5; 108 1.8,7.5; 109 1.4,7.5; 110 1,7.5; 111 0.6,7.5; 112 0.2,7.5; 113 -0.2,7.5; 114 -0.6,7.5; 115 -1,7.5; 116 -1.4,7.5; 117 -1.8,7.5; 118 -2.2,7.5; 119 -2.6,7.5; 120 -3,7.5; 121 -3.4,7.5; 122 -3.8,7.5; 123 -4.2,7.5; 124 -4.6,7.5; 125 -5,7.5; 126 -5.4,7.5; 127 -5.8,7.5; 128 -6.2,7.5 | smd 4.8 x 4.8: PAD 0,0
2X10 = drill 1.016 square: 1 -11.43,-1.27 | drill 1.016 octagon: 2 -11.43,1.27; 3 -8.89,-1.27; 4 -8.89,1.27; 5 -6.35,-1.27; 6 -6.35,1.27; 7 -3.81,-1.27; 8 -3.81,1.27; 9 -1.27,-1.27; 10 -1.27,1.27; 11 1.27,-1.27; 12 1.27,1.27; 13 3.81,-1.27; 14 3.81,1.27; 15 6.35,-1.27; 16 6.35,1.27; 17 8.89,-1.27; 18 8.89,1.27; 19 11.43,-1.27; 20 11.43,1.27

### Placement (x,y rotation side)
1V0  48.26,18.8 0 top
2V5  46.23,18.8 0 top
3V3  44.3,18.8 0 top
5V0  42.37,18.8 0 top
C1  43.47,50.88 270 top
C2  44.58,59.72 90 top
C3  40.26,45.34 90 bottom
C4  26.34,58.9 90 top
C5  28.96,50.67 180 top
C6  24.31,36.09 45 top
C10  34.82,44.83 90 bottom
C11  36.98,44.83 90 bottom
C12  44.12,44.91 90 bottom
C13  44.81,42.62 180 bottom
C14  44.81,39.8 180 bottom
C15  44.81,37.01 180 bottom
C16  42.77,35.2 270 bottom
C17  40.06,35.23 270 bottom
C18  36.65,35.23 270 bottom
C19  35.05,35.23 270 bottom
C20  34.8,37.52 0 bottom
C21  35.36,40.51 0 bottom
C22  35.36,42.09 0 bottom
C31  42.42,45.34 90 bottom
C32  43.59,41.02 180 bottom
C33  43.59,38.66 180 bottom
C34  44.81,35.86 180 bottom
C35  41.38,36.45 270 bottom
C36  38.2,36.45 270 bottom
C37  36.45,39.01 0 bottom
C38  36.53,43.1 0 bottom
CLK  32.16,50.77 0 top
GND  70.48,3.81 0 top
GND17  20.83,76.45 0 top
J0  0,80 270 top
J_TO_MASTER  7.62,70.48 90 top
J_TO_SLAVE  72.39,70.48 270 top
JP1  17.12,59.39 0 top
JP2  34.44,59.39 180 top
POR  53.92,58.37 0 top
R1  56.31,59.74 90 top
R2  47.35,59.72 90 top
R3  35.36,50.37 90 top
R4  28.6,41.15 0 top
R5  28.6,43.17 0 top
R6  37.8,28.88 270 top
R7  40.61,28.88 270 top
R8  45.51,50.88 90 top
R9  17.25,23.5 270 top
R10  53.44,33.83 180 top
R11  57.48,34.82 180 top
R12  53.44,35.86 180 top
R13  57.48,36.86 180 top
R14  53.44,37.9 180 top
R15  19.43,14.73 90 top
R16  21.46,14.73 90 top
R17  23.5,14.73 90 top
R18  25.53,14.73 90 top
R19  27.56,14.73 90 top
R20  29.59,14.73 90 top
R21  31.62,14.73 90 top
R22  33.66,14.73 90 top
R23  35.69,14.73 90 top
R24  36.07,69.09 90 top
R25  38.73,69.09 90 top
R26  46.35,71.37 90 top
R27  53.44,40.18 180 top
R28  28.42,29.26 45 top
R29  37.72,14.73 90 top
R30  28.96,47.45 0 top
R31  24.13,41.53 315 top
R32  21.03,35.71 225 top
R33  19.15,37.49 225 top
RST_N  53.21,64.14 0 top
TDO  42.52,69.11 0 top
TPID  36.01,29.09 90 top
U1  51.43,59.72 180 top
U2  23.34,58.98 270 top
U3  41.45,59.72 270 top
U4  25.43,47.98 270 top
U5  22.45,38.96 315 top
X0D11  30.89,31.6 0 top
X1  40.01,40 0 top
X1D00  59.99,40.01 0 top
XTAG  40.01,76.23 0 top

### Tracks (layer width: path | path; a pad name or v marks a point on that pad's centre or on a via)
+1V0  (via drill 0.3)
  Top 0.152: X1.126 v34.61,46.23 v34.62,46.23 | v37.01,46.23 X1.120 | X1.101 44.61,46.31 v44.7,46.21 44.21,46.71 X1.102 | X1.87 46.22,42.6 v46.2,42.62 | X1.80 v46.2,39.8 46.6,40.2 X1.81 | X1.73 v46.2,37.01 | X1.56 43.01,33.62 v42.85,33.78 | X1.60 v44.61,33.77 v44.6,33.78 | X1.49 40.21,33.65 v40.08,33.78 | X1.41 37.01,33.75 v36.98,33.78 | X1.36 v35.01,33.77 v35,33.78 | X1.17 33.68,39.8 v33.91,40.03 33.74,40.2 X1.16 | X1.11 33.9,42.2 v33.91,42.19 | X1.24 33.56,37 v33.91,36.65 | 1V0.TP v50.16,18.8
  Top 0.406: R8.1 45.57,50.09 v47.5,50.09
  Route15 0.406: v47.5,50.09 47.5,47.51 46.2,46.21
  Route15 1.016: v33.91,36.65 v33.91,40.03 v33.91,42.19 33.91,46.23 v34.61,46.23 v37.01,46.23 38.1,46.23 39.37,44.96 43.45,44.96 v44.7,46.21 46.2,46.21 v46.2,42.62 v46.2,39.8 v46.2,37.01 46.2,33.78 v44.6,33.78 v42.85,33.78 v40.08,33.78 v36.98,33.78 v35,33.78
  Route15 1.676: J0.13 v50.16,18.8 50.16,19.3 50.16,29.82 46.2,33.78
  Bottom 0.152: C11.2 36.98,46.2 v37.01,46.23 | v34.61,46.23 34.82,46.02 C10.2 | v44.7,46.21 C12.2 | C13.2 v46.2,42.62 | C14.2 v46.2,39.8 | C15.2 v46.2,37.01 | C16.2 42.77,33.86 v42.85,33.78 | C17.2 40.06,33.81 v40.08,33.78 | C20.2 34.2,36.94 v33.91,36.65 | C21.2 34.45,40.32 34.16,40.03 v33.91,40.03 | C22.2 34.01,42.09 v33.91,42.19 | C19.2 35.05,33.83 v35,33.78 | v36.98,33.78 36.65,34.11 C18.2
+2V5  (via drill 0.3)
  Top 0.152: X1.110 41.01,46.77 v41.33,46.46 40.78,46.46 40.61,46.62 X1.111 | 2V5.TP 46.23,15.98 v47.62,14.58
  Top 0.61: v47.62,14.58 v53.65,14.58
  Route15 0.61: v41.33,46.46 42.42,46.46 47.98,52.02 53.26,52.02 53.65,51.64 v53.65,14.58 | J0.15 v47.62,14.58
  Bottom 0.152: C3.2 40.78,46.46 v41.33,46.46
+3V3  (via drill 0.3)  (1 unrouted)
  Top 0.152: v45.26,44.58 45.21,44.6 X1.92 | v45.01,41.02 arc90 45.03,41 47.55,41 | X1.78 46.39,39 46.1,38.71 v45.01,38.71 | X1.67 45.39,34.59 v45.01,34.98 | X1.52 41.41,34.96 v41.43,34.98 | X1.44 38.21,33.6 | 38.21,33.6 38.21,34.94 v38.18,34.98 | X1.42 37.41,33.4 37.62,33.6 38.21,33.6 | X1.29 33.78,35 v33.81,34.98 | X1.19 35.09,39 v35.1,39.01 | X1.6 33.37,44.2 34.29,43.28 v35.1,43.28 | X1.14 33.51,41 33.81,41.3 v35.1,41.3 | X1.105 43.01,46.02 v43.09,45.94 | 44.56,60.58 C2.2 | R2.2 | 26.33,59.77 C4.2 | R9.1 17.03,24.38 v18.29,24.38 | U1.5 50.36,59.69 | 3V3.TP v44.3,17.5
  Top 0.254: R2.2 v47.35,61.85 | C2.2 v44.58,61.85 | R1.2 v56.31,61.44 | U3.1 43.05,61.01 43.48,60.58 44.56,60.58 | R2.2 49.02,60.58 49.28,60.33 49.28,59.94 49.53,59.69 50.36,59.69 | C4.2 27.27,59.75 v27.48,59.54 | U2.1 24.89,60.27 25.4,59.77 26.33,59.77 | v25.81,37.54 25.02,36.75 24.98,36.62 C6.2 24.82,36.69 22.96,38.56 22.96,39.78 U5.1 | v27.15,50.67 C5.2 28.09,50.66 28.09,49.61 27.76,49.28 U4.1
  Route15 0.254: v27.15,50.67 27.15,50.7
  Bottom 0.152: C32.2 v45.01,41.02 | C33.2 44.98,38.66 v45.01,38.71 | C34.2 45.41,35.65 45.41,35.61 45.41,35.38 v45.01,34.98 | C35.2 41.38,35.03 v41.43,34.98 | C36.2 38.2,35 v38.18,34.98 | C37.2 v35.1,39.01 | C38.2 35.26,43.13 v35.1,43.28 | C31.2 v43.09,45.94
  pour Route15: -2.36,81.58 -2.36,-1.19 82.47,-1.19 82.47,81.58
+5V  (via drill 0.3)
  Top 0.152: R6.2 v37.8,26.11 | v40.26,26.11 40.26,18.8 | 40.26,18.8 40.26,17.7 v42.55,15.42 | 5V0.TP 40.26,18.8
  Route2 0.152: v37.8,26.11 v40.26,26.11 | v42.55,15.42 J0.19
CLK0  (via drill 0.3)
  Top 0.152: J_TO_SLAVE.13 61.85,60.33 58.6,57.07 30.99,57.07 28.92,59.14 | 19.66,61.19 13.06,61.19 12.19,60.33 J_TO_MASTER.13 | 19.66,61.19 22.4,61.19 | JP1.3 19.66,61.19 | U2.3 22.4,61.19 | 28.92,59.14 26.87,61.19 22.4,61.19 | v28.32,58.55 28.92,59.14
  Route2 0.152: J0.101 35.05,7.48 35.05,21.84 28.32,28.57 v28.32,58.55
CLK1  (via drill 0.3)
  Top 0.152: J_TO_MASTER.15 3.91,58.95 11.4,58.95 13.59,56.77 14.58,56.77 | J_TO_SLAVE.15 76.22,59.08 61.95,59.08 59.64,56.77 27.69,56.77 | 14.58,56.77 22.4,56.77 | 22.4,56.77 27.69,56.77 | JP1.1 14.58,56.77 | U2.4 22.4,56.77 | v27.69,57.53 27.69,56.77
  Route2 0.152: J0.102 36.2,3.8 36.2,5.84 34.67,7.37 34.67,21.72 27.94,28.45 27.94,57.28 v27.69,57.53
CLK2  (via drill 0.3)
  Top 0.152: 25.02,62.87 31.9,62.87 | J_TO_SLAVE.10 40.51,62.87 | 40.51,62.87 31.9,62.87 | U3.3 40.51,62.87 | JP2.3 31.9,62.87 | v24.51,62.87 25.02,62.87 | 25.02,62.87 J_TO_MASTER.10
  Route2 0.152: J0.103 33.4,6.59 33.4,16.89 24.51,25.78 v24.51,62.87
CLK3  (via drill 0.3)
  Top 0.152: J_TO_SLAVE.12 76.22,61.62 61.75,61.62 57.53,57.4 40.51,57.4 | 36.96,57.4 40.51,57.4 | J_TO_MASTER.12 3.79,61.62 24,61.62 | 24,61.62 26.87,61.62 31.09,57.4 36.96,57.4 | JP2.1 36.96,59.36 36.96,57.4 | U3.4 40.51,57.4 | v24,61.72 24,61.62
  Route2 0.152: J0.104 33.66,3.8 33.66,5.84 33.02,6.48 33.02,16.51 24,25.53 v24,61.72
CLK_A  (via drill 0.3)
  Top 0.152: X1.125 35.01,48.02 34.04,49 34.04,50.52 32.74,51.82 32.13,51.82 | 32.13,51.82 23.55,51.82 v23.37,51.64 | JP1.2 18.9,57.1 20.45,57.1 22.12,58.78 24.08,58.78 24.28,58.57 U2.5 23.37,57.68 v23.37,57.66 | CLK.TP 32.13,50.67 32.13,51.82
  Route2 0.152: v23.37,57.66 v23.37,51.64
CLK_B  (via drill 0.3)
  Top 0.152: JP2.2 34.44,60.22 35.94,61.72 37.85,61.72 39.88,59.69 42.04,59.69 42.39,59.33 U3.5 v41.43,58.42 | v26.67,63.37 v34.42,63.37 | v42.44,55.78 v55.27,55.78 | v55.3,40.18 R27.1 | R28.1 26.67,27.51 v26.67,27.43
  Route2 0.152: v26.67,27.43 v26.67,63.37 | v41.43,58.42 41.43,56.79 v42.44,55.78 | v55.27,55.78 55.3,55.75 v55.3,40.18 | v34.42,63.37 34.42,59.41 JP2.2
GND  (via drill 0.3, 0.6)
  Top 0.152: X1.PAD v41.27,38.73
  other vias: 43.36,58.88 45.75,58.85 53.8,59.72 41.43,62.28 25.17,58.06 43.48,52.88 38.73,41.27 41.27,41.27 38.73,38.73 41.78,28.04 60.33,31.5 50.8,53.98 47.24,67.44 55.88,66.04 61.21,67.31 61.21,68.58 26.54,7.34 27.94,7.34 29.21,7.34 30.61,7.34 21.49,59.21 21.74,67.34 20.47,62.26 62.51,54.66 62.51,52.12 62.51,49.58 62.76,59.74 62.64,40.18 62.64,37.39 62.64,36.37 62.64,35.36 62.51,26.72 62.51,25.45 62.51,24.18 62.51,22.91 62.51,19.1 62.51,16.56 62.51,14.02 62.51,11.35 63.4,8.81 17.04,31.67 17.04,29.26 17.04,26.72 19.58,25.07 16.28,21.51 16.03,19.1 13.49,16.38 11.71,13.84 10.82,11.3 9.55,8.71 14.63,52.12 16.15,54.66 9.55,55.8 25.76,26.54 22.35,38.94 22.2,41.83 19.66,39.42 17.04,33.45 17.68,36.12 25.22,47.98 25.22,50.6 29.79,49.58 10.87,44.48 10.85,46.94 10.85,49.45 10.82,50.95
  pour Bottom: -1.47,81.2 81.33,81.2 81.33,2.31 81.33,-1.3 3.81,-1.3 -1.47,-1.3
  pour Top: -3.4,82.58 -3.4,-2.11 83.16,-2.11 83.16,82.58
IO1  (via drill 0.3)
  Top 0.152: J0.110 28.57,3.8 28.57,8.38 29.08,8.89 v35.69,8.89 | v35.69,12.7 R23.1
  Route2 0.152: v35.69,8.89 v35.69,12.7
IO2  (via drill 0.3)
  Top 0.152: J0.107 29.84,7.75 30.1,8 v37.72,8 | v37.72,12.7 R29.1
  Route2 0.152: v37.72,8 v37.72,12.7
N$1
  Top 0.152: X1.74 48.05,37.4 51.61,33.83 R10.2
N$2
  Top 0.152: X1.75 48.87,37.8 51.84,34.82 R11.2
N$3
  Top 0.152: X1.76 48.97,38.2 51.31,35.87 R12.2
N$4
  Top 0.152: X1.77 49.05,38.6 50.8,36.85 R13.2
N$5
  Top 0.152: X1.79 48.76,39.4 50.27,37.9 R14.2
N$6
  Top 0.152: U4.5 27.99,46.69 28.11,46.8 R30.1
N$7
  Top 0.152: R31.2 25.35,40.31 25.35,40.03 U5.5
N$10
  Top 0.152: U5.4 R32.1
N$11
  Top 0.152: U5.3 R33.1
PLL_AVDD
  Top 0.152: X1.103 43.81,48.18 44.7,49.07 44.7,50.02 | C1.2 44.7,50.02 | R8.2 44.84,51.73 44.7,51.59 44.7,50.02
POR  (via drill 0.3)
  Top 0.152: U1.1 52.45,59.04 v52.45,57.96 52.45,58.37 POR.TP | J0.109 27.3,8.13 28.96,9.78 v52.45,9.78
  Route2 0.152: v52.45,57.96 v52.45,9.78
RST_N  (via drill 0.3)
  Top 0.152: X1.124 35.41,48.05 34.37,49.1 v34.37,51.21 35.34,51.21 R3.2 | v38.99,63.37 v49,63.37 52.45,63.37 RST_N.TP | R2.1 48.81,58.87 v49,59.05 U1.6 51.18,59.05 51.44,59.31 51.44,60.2 51.26,60.38 U1.4
  Route2 0.152: v34.37,51.21 34.37,53.42 38.99,58.04 v38.99,63.37 | v49,59.05 v49,63.37
RX0
  Top 0.152: J0.120 13.21,3.93 13.21,6.6 19.43,12.83 R15.1
RX1
  Top 0.152: J0.118 16.13,3.55 16.13,5.97 23.5,13.34 R17.1
SCL0
  Top 0.152: J0.116 18.67,3.55 18.67,5.71 19.3,6.35 19.81,6.35 26.67,13.21 26.67,13.72 26.84,13.88 R19.1 27.56,13.72
SCL1
  Top 0.152: J0.114 21.21,3.55 21.21,5.71 27.69,12.19 31.24,12.19 31.62,12.57 R21.1
SDA0
  Top 0.152: J0.115 27.44,12.83 29.46,12.83 29.59,12.95 R20.1
SDA1
  Top 0.152: R22.1 33.66,11.94 33.15,11.43 28.33,11.43 22.23,5.32 J0.113
TCK  (via drill 0.3)
  Top 0.152: X1.128 33.81,48.05 32.79,49.07 v32.79,49.63 | R25.1 38.73,67.06 38.35,66.67 v33.15,66.67 3.81,66.67 J_TO_MASTER.6 | v33.15,64.39 49.94,64.39 52.22,66.67 76.19,66.67 J_TO_SLAVE.6
  Route2 0.152: v32.79,49.63 32.79,57.17 33.15,57.53 v33.15,64.39 | v33.15,64.39 v33.15,66.67 | v33.15,64.39 33.15,64.9
TCK_  (via drill 0.3)
  Top 0.152: R25.2 v38.74,70.96 v38.73,70.97
  Route2 0.152: v38.73,70.97 XTAG.9
TDI  (via drill 0.3)
  Top 0.152: X1.2 31.95,45.8 31.65,46.1 29.16,46.1 v28.96,46.3 | J_TO_MASTER.3 3.81,71.75 4.19,72.14 28.45,72.14 v28.96,71.63 v33.66,71.63
  Route2 0.152: v33.66,71.63 XTAG.5 | v28.96,46.3 v28.96,71.63
TDO  (via drill 0.3)
  Top 0.152: X1.1 32.51,48.54 v32.11,48.95 | J_TO_SLAVE.3 76.19,69.22 52.35,69.22 48.92,65.79 41.27,65.79 | 41.27,65.79 v30.73,65.79 | TDO.1 41.27,67.82 41.27,65.79
  Route2 0.152: v32.11,48.95 32.08,56.44 30.73,57.78 v30.73,65.79
TDO_CHAIN
  Top 0.152: J_TO_MASTER.1 7.62,70.43 7.68,70.49 31.87,70.49 33.27,69.09 43.81,69.09 | TDO.3 43.81,67.86 43.81,69.09 | 43.81,69.09 51.03,69.09 52.43,70.48 J_TO_SLAVE.1
TDO_XTAG
  Top 0.152: TDO.2 TDO.4 43.8,74.93 XTAG.13
TMS  (via drill 0.3)
  Top 0.152: X1.127 34.21,48.16 33.5,48.87 v33.5,50.34 | v37.34,68.2 37.3,68.24 R24.1 35.09,68.24 34.75,67.89 7.67,67.89 J_TO_MASTER.4 | v37.34,64.9 49.25,64.9 52.3,67.95 J_TO_SLAVE.4
  Route2 0.152: v37.34,68.2 v37.34,64.9 37.34,62.74 35.69,61.09 35.69,57.53 33.5,55.35 v33.5,50.34
TMS_  (via drill 0.3)
  Top 0.152: R24.2 36.2,70.07 v36.2,70.96 v36.2,70.97
  Route2 0.152: v36.2,70.97 XTAG.7
TRST_N
  Top 0.152: X1.123 35.81,48.21 35.36,48.67 R3.1
TX0
  Top 0.152: J0.119 14.61,6.22 21.46,13.08 R16.1
TX1
  Top 0.152: J0.117 25.53,13.45 R18.1
USB_ID
  Top 0.152: X1.43 37.81,31.94 36.02,30.15 TPID.TP
USB_N
  Top 0.152: X1.47 39.41,16.55 arc90 39.8,16.16 40.21,16.16 arc-90 40.6,15.78 40.6,15.75 arc-90 40.21,15.37 39.8,15.37 arc90 39.41,14.98 39.41,14.96 arc90 39.8,14.57 40.21,14.57 arc-90 40.6,14.18 40.6,14.16 arc-90 40.21,13.77 39.8,13.77 arc90 39.41,13.39 39.41,11.48 38.37,10.44 28.71,10.44 24.77,6.5 J0.111
USB_P
  Top 0.152: X1.46 39.01,11.51 38.24,10.74 28.59,10.74 23.57,5.73 23.57,3.72 J0.112
USB_RTUNE
  Top 0.152: X1.48 39.81,31.95 40.62,31.14 R7.1
USB_VBUS
  Top 0.152: X1.45 38.61,31.93 37.8,31.11 R6.1
X0D00
  Top 0.152: X1.30 31.96,34.6 17.05,19.69 7.65,19.69 7.64,19.68 J_TO_MASTER.61
X0D01
  Top 0.152: X1.27 31.86,35.8 18.29,22.23 17.05,22.23 | 17.05,22.23 7.64,22.23 7.62,22.25 J_TO_MASTER.58 | 17.05,22.23 R9.2
X0D02
  Top 0.152: X1.37 35.41,31.96 27.91,24.46 24.51,24.46 12.06,12.01 7.67,12.01 J_TO_MASTER.70
X0D03
  Top 0.152: X1.38 35.81,31.92 28.02,24.13 24.69,24.13 11.38,10.82 3.79,10.82 2.56,12.04 J_TO_MASTER.72
X0D04
  Top 0.152: X1.31 31.99,34.2 16.26,18.47 3.76,18.47 J_TO_MASTER.63
X0D05
  Top 0.152: X1.33 33.81,31.96 27.3,25.45 24.13,25.45 14.58,15.9 3.79,15.9 J_TO_MASTER.66
X0D06
  Top 0.152: X1.34 34.21,31.92 27.41,25.12 24.26,25.12 13.69,14.55 7.67,14.55 7.64,14.58 J_TO_MASTER.67
X0D07
  Top 0.152: X1.35 34.61,31.89 27.51,24.79 24.38,24.79 12.95,13.36 3.81,13.36 J_TO_MASTER.69
X0D08  (via drill 0.3)
  Top 0.152: X1.39 36.21,31.59 v29.21,24.59 | R21.2 v31.62,19.36 | v29.21,24.59 29.22,24.57 | v29.21,24.59 28.42,23.8 24.84,23.8 10.52,9.47 7.67,9.47 J_TO_MASTER.73
  Route2 0.152: v31.62,19.36 31.62,22.17 v29.21,24.59
X0D09  (via drill 0.3)
  Top 0.152: X1.40 36.61,31.25 30.18,24.82 | J_TO_MASTER.75 3.83,8.23 9.78,8.23 25.02,23.47 28.83,23.47 30.18,24.82 | R22.2 v33.66,19.38 | 30.18,24.82 v30.18,24.84
  Route2 0.152: v33.66,19.38 33.66,21.36 v30.18,24.84
X0D10
  Top 0.152: X1.28 31.97,35.4 17.55,20.98 3.79,20.98 J_TO_MASTER.60
X0D11
  Top 0.152: 32.51,32.66 32.51,31.09 27.2,25.78 24,25.78 15.32,17.09 7.67,17.09 7.64,17.12 J_TO_MASTER.64 | 32.51,32.66 X1.32 | R28.2 30.89,31.73 | 32.51,32.66 31.83,32.66 30.89,31.73 | 30.89,31.73 X0D11.TP
X0D12
  Top 0.152: X1.62 45.41,31.55 58.5,18.47 76.25,18.47 J_TO_SLAVE.63
X0D13
  Top 0.152: X1.63 45.81,31.64 57.76,19.69 72.44,19.69 72.44,19.68 J_TO_SLAVE.61
X0D14  (via drill 0.3)
  Top 0.152: J_TO_SLAVE.69 76.22,13.36 60.76,13.36 v44.48,29.64 43.41,30.71 X1.57 | R15.2 19.43,17.14 25.22,22.94 v37.16,22.94
  Route2 0.152: v37.16,22.94 37.85,23.62 38.46,23.62 v44.48,29.64
X0D15  (via drill 0.3)
  Top 0.152: X1.58 43.81,31.17 v46.13,28.85 60.37,14.61 J_TO_SLAVE.67 | R17.2 23.5,19.96 25.3,21.77 v37.13,21.77
  Route2 0.152: v37.13,21.77 39.04,21.77 v46.13,28.85
X0D16
  Top 0.152: X1.68 48.06,35 58.26,24.82 59.59,23.5 76.19,23.5 J_TO_SLAVE.57
X0D17
  Top 0.152: X1.69 48.12,35.4 58.74,24.77 J_TO_SLAVE.55
X0D18
  Top 0.152: X1.70 48.17,35.8 57.94,26.04 76.19,26.04 J_TO_SLAVE.54
X0D19
  Top 0.152: X1.71 48.26,36.2 57.15,27.31 J_TO_SLAVE.52
X0D20  (via drill 0.3)  (1 unrouted)
  Top 0.152: X1.59 44.21,31.53 v48.54,27.2 59.74,16 76.48,16 77.47,16.99 J_TO_SLAVE.66 | R29.2 37.72,16.87
  Route2 0.152: v37.72,16.76 38.1,16.76 v48.54,27.2
X0D21
  Top 0.152: X1.61 45.01,31.5 59.35,17.15 J_TO_SLAVE.64
X0D22  (via drill 0.3)
  Top 0.152: X1.64 46.21,31.97 48.88,29.3 | 48.88,29.3 57.2,20.98 76.22,20.98 J_TO_SLAVE.60 | R20.2 29.59,19.81 29.97,20.19 v36.3,20.19 | v48.87,29.26 48.88,29.27 48.88,29.3
  Route2 0.152: v36.3,20.19 39.8,20.19 v48.87,29.26
X0D23  (via drill 0.3)
  Top 0.152: X1.66 48.05,34.2 v50.49,31.75 60.02,22.23 J_TO_SLAVE.58 | R19.2 27.56,20.32 27.91,20.68 v37.08,20.68
  Route2 0.152: v37.08,20.68 39.42,20.68 v50.49,31.75
X0D24
  Top 0.152: X1.88 48.06,43 49.76,41.3 76.22,41.3 J_TO_SLAVE.36
X0D25
  Top 0.152: X1.89 48.12,43.4 49.89,41.63 71.47,41.63 J_TO_SLAVE.34
X0D26  (via drill 0.3)
  Top 0.152: X1.93 48.04,45 50.04,43 v51.03,43 55.5,43 55.88,42.62 67.84,42.62 71.6,46.38 76.22,46.38 J_TO_SLAVE.30 | R16.2 21.46,18.57 25.25,22.35 v36.3,22.35
  Route2 0.152: v36.3,22.35 38.73,22.35 51.03,34.65 v51.03,43
X0D27  (via drill 0.3)
  Top 0.152: X1.94 48.1,45.4 49.99,43.51 v51.71,43.51 55.45,43.51 56.01,42.95 67.71,42.95 J_TO_SLAVE.28 | R18.2 25.53,20.65 26.11,21.23 v36.3,21.23
  Route2 0.152: v36.3,21.23 39.29,21.23 51.71,33.66 v51.71,43.51
X0D28  (via drill 0.3)
  Top 0.152: X1.96 v50.06,46.2 | v50.06,46.2 55.55,46.2 59.52,50.17 72.36,50.17 72.36,50.16 J_TO_SLAVE.25 | R23.2 35.69,17.48 35.94,17.73 37.87,17.73 38.12,17.98 v38.12,22.86 | v50.06,46.2
  Route2 0.152: v50.06,46.2 50.06,34.54 38.38,22.86 v38.12,22.86 38.1,22.86
X0D29
  Top 0.152: X1.98 45.81,48.07 46,48.26 55.37,48.26 59.82,52.71 J_TO_SLAVE.22
X0D30
  Top 0.152: X1.99 45.41,48.26 45.74,48.59 53.92,48.59 59.33,54 76.22,54 J_TO_SLAVE.21
X0D31
  Top 0.152: X1.100 45.01,48.36 45.57,48.92 52.73,48.92 59.06,55.25 J_TO_SLAVE.19
X0D32
  Top 0.152: J_TO_SLAVE.27 76.3,49 58.83,49 55.42,45.59 48.46,45.59 48.26,45.8 X1.95
X0D33
  Top 0.152: X1.97 55.88,47.5 59.84,51.46 76.22,51.46 J_TO_SLAVE.24
X0D34
  Top 0.152: X1.90 48.17,43.8 50.01,41.96 69.72,41.96 71.6,43.84 76.22,43.84 J_TO_SLAVE.33
X0D35
  Top 0.152: X1.91 48.28,44.2 50.19,42.29 69.59,42.29 J_TO_SLAVE.31
X0D36  (via drill 0.3)
  Top 0.152: X1.3 31.84,45.4 31.44,45.8 v23.29,45.8 | v21.54,45.8 21.54,44.6 18.24,41.3 3.79,41.3 J_TO_MASTER.36
  Route2 0.152: v23.29,45.8 v21.54,45.8
X0D37
  Top 0.152: X1.4 31.76,45 31.27,45.49 24.84,45.49 16.76,37.41 7.67,37.41 J_TO_MASTER.40
X0D38  (via drill 0.3)
  Top 0.152: X1.5 30.08,44.6 29.79,44.88 v29.79,44.98 | v29.79,46.58 29.81,46.59 R30.2
  Route2 0.152: v29.79,44.98 v29.79,46.58
X0D38_N
  Top 0.152: U4.4 24.49,47.12 23.62,47.98 23.05,47.98 22.5,47.44 22.5,44.13 17.18,38.81 3.73,38.81 J_TO_MASTER.39
X0D38_P
  Top 0.152: U4.3 24.49,49.15 23.62,48.28 22.92,48.28 22.2,47.56 22.2,44.26 17.06,39.12 16.23,39.12 arc-90 15.96,39.38 15.96,39.54 arc90 15.7,39.8 15.65,39.8 arc90 15.38,39.54 15.38,39.38 arc-90 15.12,39.12 15.07,39.12 arc-90 14.8,39.38 14.8,39.54 arc90 14.54,39.8 14.49,39.8 arc90 14.23,39.54 14.23,39.38 arc-90 13.96,39.12 13.91,39.12 arc-90 13.65,39.38 13.65,39.54 arc90 13.38,39.8 13.33,39.8 arc90 13.07,39.54 13.07,39.38 arc-90 12.8,39.12 12.76,39.12 arc-90 12.49,39.38 12.49,39.54 arc90 12.22,39.8 12.18,39.8 arc90 11.91,39.54 11.91,39.38 arc-90 11.64,39.12 11.6,39.12 arc-90 11.33,39.38 11.33,39.54 arc90 11.06,39.8 11.02,39.8 arc90 10.75,39.54 10.75,39.38 arc-90 10.48,39.12 10.44,39.12 arc-90 10.17,39.38 10.17,39.54 arc90 9.9,39.8 9.86,39.8 arc90 9.59,39.54 9.59,39.38 arc-90 9.32,39.12 8.51,39.12 J_TO_MASTER.37
X0D39
  Top 0.152: X1.7 31.89,43.8 31.42,44.27 25.43,44.27 23.53,42.38 R31.1
X0D39_N
  Top 0.152: R33.2 18.55,35.28 18.07,34.8 17.73,34.8 arc-90 17.46,35.06 17.46,35.2 arc90 17.2,35.47 17.14,35.47 arc90 16.88,35.2 16.88,35.06 arc-90 16.61,34.8 16.56,34.8 arc-90 16.29,35.06 16.29,35.2 arc90 16.02,35.47 15.97,35.47 arc90 15.7,35.2 15.7,35.06 arc-90 15.44,34.8 15.38,34.8 arc-90 15.12,35.06 15.12,35.2 arc90 14.85,35.47 14.8,35.47 arc90 14.53,35.2 14.53,35.06 arc-90 14.27,34.8 14.21,34.8 arc-90 13.95,35.06 13.95,35.2 arc90 13.68,35.47 13.63,35.47 arc90 13.36,35.2 13.36,35.06 arc-90 13.09,34.8 13.04,34.8 arc-90 12.77,35.06 12.77,35.2 arc90 12.51,35.47 12.45,35.47 arc90 12.19,35.2 12.19,35.06 arc-90 11.92,34.8 11.87,34.8 arc-90 11.6,35.06 11.6,35.2 arc90 11.33,35.47 11.28,35.47 arc90 11.02,35.2 11.02,35.06 arc-90 10.75,34.8 10.7,34.8 arc-90 10.43,35.06 10.43,35.2 arc90 10.16,35.47 10.11,35.47 arc90 9.84,35.2 9.84,35.06 arc-90 9.58,34.8 7.75,34.8 J_TO_MASTER.43
X0D39_P
  Top 0.152: R32.2 18.82,35.11 18.2,34.49 9.07,34.49 8.23,33.66 3.81,33.66 J_TO_MASTER.45
X0D42
  Top 0.152: X1.10 30.86,42.6 30.29,43.17 R5.2
X0D43
  Top 0.152: X1.12 30.93,41.8 30.28,41.15 R4.2
X1D00
  Top 0.152: X1.85 48.09,41.8 50.52,39.37 52.58,39.37 | J_TO_SLAVE.39 76.22,38.76 72.03,38.76 71.42,39.37 59.72,39.37 | R27.2 52.58,39.81 52.58,39.37 | 52.58,39.37 59.72,39.37 | X1D00.TP 59.72,39.73 59.72,39.37
X1D01
  Top 0.152: X1.86 48.15,42.2 49.38,40.97 71.43,40.97 J_TO_SLAVE.37
X1D02
  Top 0.152: X1.72 48.34,36.6 56.34,28.6 76.22,28.6 J_TO_SLAVE.51
X1D03
  Top 0.152: R10.1 68.41,33.83 J_TO_SLAVE.49
X1D04
  Top 0.152: R11.1 68.33,34.82 72.01,31.14 76.22,31.14 J_TO_SLAVE.48
X1D05
  Top 0.152: R12.1 68.92,35.87 J_TO_SLAVE.46
X1D06
  Top 0.152: R13.1 68.76,36.85 71.93,33.68 76.22,33.68 J_TO_SLAVE.45
X1D07
  Top 0.152: R14.1 69.42,37.9 J_TO_SLAVE.43
X1D08
  Top 0.152: X1.82 48.05,40.6 49.94,38.71 69.57,38.71 72.06,36.22 76.22,36.22 J_TO_SLAVE.42
X1D09
  Top 0.152: X1.84 48.06,41.4 50.42,39.04 70.82,39.04 J_TO_SLAVE.40
X1D10
  Top 0.152: X1.121 36.61,51.78 35.92,52.48 20.52,52.48 11.89,43.84 3.79,43.84 J_TO_MASTER.33
X1D11
  Top 0.152: X1.122 36.21,51.75 35.81,52.15 20.68,52.15 11.07,42.55 J_TO_MASTER.34
X1D14
  Top 0.152: X1.51 41.01,31.91 41.4,31.52 41.4,29.52 62.66,8.26 76.19,8.26 J_TO_SLAVE.75
X1D15
  Top 0.152: J_TO_SLAVE.73 62.17,9.53 41.81,29.89 X1.53
X1D16
  Top 0.152: X1.22 31.91,37.8 21.36,27.25 7.67,27.25 J_TO_MASTER.52
X1D17
  Top 0.152: X1.23 31.96,37.4 20.6,26.04 3.81,26.04 J_TO_MASTER.54
X1D18
  Top 0.152: X1.25 31.7,36.6 20.8,25.7 8.55,25.7 J_TO_MASTER.55
X1D19
  Top 0.152: X1.26 31.78,36.2 19.1,23.52 3.79,23.52 J_TO_MASTER.57
X1D20
  Top 0.152: J_TO_SLAVE.72 76.22,10.82 61.72,10.82 42.21,30.33 X1.54
X1D21
  Top 0.152: J_TO_SLAVE.70 72.42,12.06 72.41,12.07 61.26,12.07 42.61,30.72 X1.55
X1D26
  Top 0.152: X1.112 40.21,53.59 38.68,55.12 19.1,55.12 17.98,54 3.79,54 J_TO_MASTER.21
X1D27
  Top 0.152: X1.113 39.81,53.38 38.41,54.79 19.28,54.79 17.14,52.65 7.67,52.65 J_TO_MASTER.22
X1D28
  Top 0.152: X1.114 39.41,53.17 38.12,54.46 19.46,54.46 16.43,51.44 3.81,51.44 J_TO_MASTER.24
X1D29
  Top 0.152: X1.115 39.01,52.96 37.85,54.13 19.63,54.13 15.67,50.16 J_TO_MASTER.25
X1D30
  Top 0.152: X1.116 38.61,52.75 37.57,53.8 19.81,53.8 14.94,48.92 3.79,48.92 J_TO_MASTER.27
X1D31
  Top 0.152: X1.117 38.21,52.54 37.29,53.47 19.99,53.47 14.15,47.62 J_TO_MASTER.28
X1D32
  Top 0.152: X1.118 37.81,52.34 37.01,53.14 20.17,53.14 13.41,46.38 3.79,46.38 J_TO_MASTER.30
X1D33
  Top 0.152: X1.119 37.41,52.12 36.73,52.81 20.34,52.81 12.62,45.09 J_TO_MASTER.31
X1D35
  Top 0.152: X1.13 31.57,41.4 23.62,33.45 23.22,33.45 18.69,37.97 18.29,37.97 16.51,36.2 3.81,36.2 J_TO_MASTER.42
X1D36
  Top 0.152: X1.15 31.99,40.6 23.72,32.33 7.7,32.33 7.64,32.38 J_TO_MASTER.46
X1D37
  Top 0.152: X1.18 31.22,39.4 22.96,31.14 3.79,31.14 J_TO_MASTER.48
X1D38
  Top 0.152: X1.20 31.72,38.6 22.91,29.79 7.72,29.79 | 7.72,29.79 | 7.72,29.79 7.67,29.79 J_TO_MASTER.49
X1D39
  Top 0.152: X1.21 31.82,38.2 22.23,28.6 3.79,28.6 J_TO_MASTER.51
X1D40  (via drill 0.3)
  Top 0.152: X1.106 42.61,53.76 39.93,56.44 12.78,56.44 10.77,58.45 v9.83,58.45 | v9.83,64.16 3.79,64.16 J_TO_MASTER.9
  Route2 0.152: v9.83,58.45 v9.83,64.16
X1D41
  Top 0.152: X1.107 42.21,53.52 39.62,56.11 12.04,56.11 10.36,57.78 J_TO_MASTER.16
X1D42
  Top 0.152: X1.108 41.81,53.26 39.29,55.78 11.89,55.78 11.18,56.49 3.83,56.49 J_TO_MASTER.18
X1D43
  Top 0.152: X1.109 41.41,53.03 38.99,55.45 18.92,55.45 18.72,55.24 J_TO_MASTER.19
XL0_IN_0  (via drill 0.3)
  Top 0.152: X1.9 30.96,43 30.48,43.48 v30.48,43.79 | XTAG.14 42.57,76.25 40.69,76.25 40.11,75.67 40.11,73.86 39.45,73.2 v29.62,73.2
  Route2 0.152: v30.48,43.79 30.48,56.9 29.62,57.76 v29.62,73.2
XL0_IN_1  (via drill 0.3)
  Top 0.152: v31.17,43.54 31.3,43.4 X1.8 | XTAG.18 47.68,76.28 43.08,76.28 42.42,75.62 42.42,72.85 41.99,72.42 v30.86,72.42
  Route2 0.152: v31.17,43.54 31.17,56.84 30.23,57.78 30.23,71.75 30.86,72.39 v30.86,72.42
XL0_OUT_0  (via drill 0.3)
  Top 0.152: R5.1 26.4,43.17 v26.19,43.38
  Route2 0.152: v26.19,43.38 26.19,75.29 27.18,76.28 37.52,76.28 XTAG.10
XL0_OUT_1  (via drill 0.3)
  Top 0.152: R4.1 26.42,41.15 25.7,41.86 v25.7,42.44
  Route2 0.152: XTAG.6 32.24,78.92 26.75,78.92 25.7,77.88 v25.7,42.44
XSYS_RST_N  (via drill 0.3)
  Top 0.152: J_TO_MASTER.7 7.62,65.35 7.68,65.41 27.55,65.41 29.08,63.88 50.37,63.88 51.92,65.43 v57.66,65.43 72.39,65.43 J_TO_SLAVE.7 | R26.1 50.86,70.52 51.71,71.37 v57.66,71.37 | v57.66,58.88 56.12,58.88 R1.1 56.3,58.88 55.17,58.88 54.99,59.05 54.99,60.27 54.89,60.38 U1.3
  Route2 0.152: v57.66,71.37 v57.66,65.43 v57.66,58.88
XSYS_RST_N_
  Top 0.152: R26.2 XTAG.15

### Text on the board
tPlace: GND | TDI|TDO_CHAIN | TDO_CHAIN|TDO | TCK|TMS | TMS|TCK | 140|XSYS_RST | XSYS_RST| | C..3|CLK2 | CLK2|C..3 | C..1|0 | CLK0|C..1 | 142|.. | 126|143 | 031|030 | 128|127 | 029|033 | 130|129 | 028|032 | 132|131 | 027|026 | 110|133 | 035|034 | 036|111 | 025|024 | 38N|38P | 101|100 | 135|037 | 109|108 | 39P|39N | 107|106 | 137|136 | 105|104 | 139|138 | 103|102 | 117|116 | 019|018 | 119|118 | 017|016 | 010|001 | 023|022 | 004|000 | 013|012 | 005|011 | 021|020 | 007|006 | 015|014 | 003|002 | 121|120 | 009|008 | 115|114 | .IO2 | RX1.TX1 | SC0.SD0 | SC1.SD1 | USP.USN | IO1.POR | CL3.CL2 | CL1.CL0 | 5V0 | 3V3 | 2V5 | 1V0 | RX0.TX0
tNames: 25 | 16.11.09.A | XEF216-512-TQ128